# Altium project SDC_V3.0.PrjPcb (part 1 of 2)
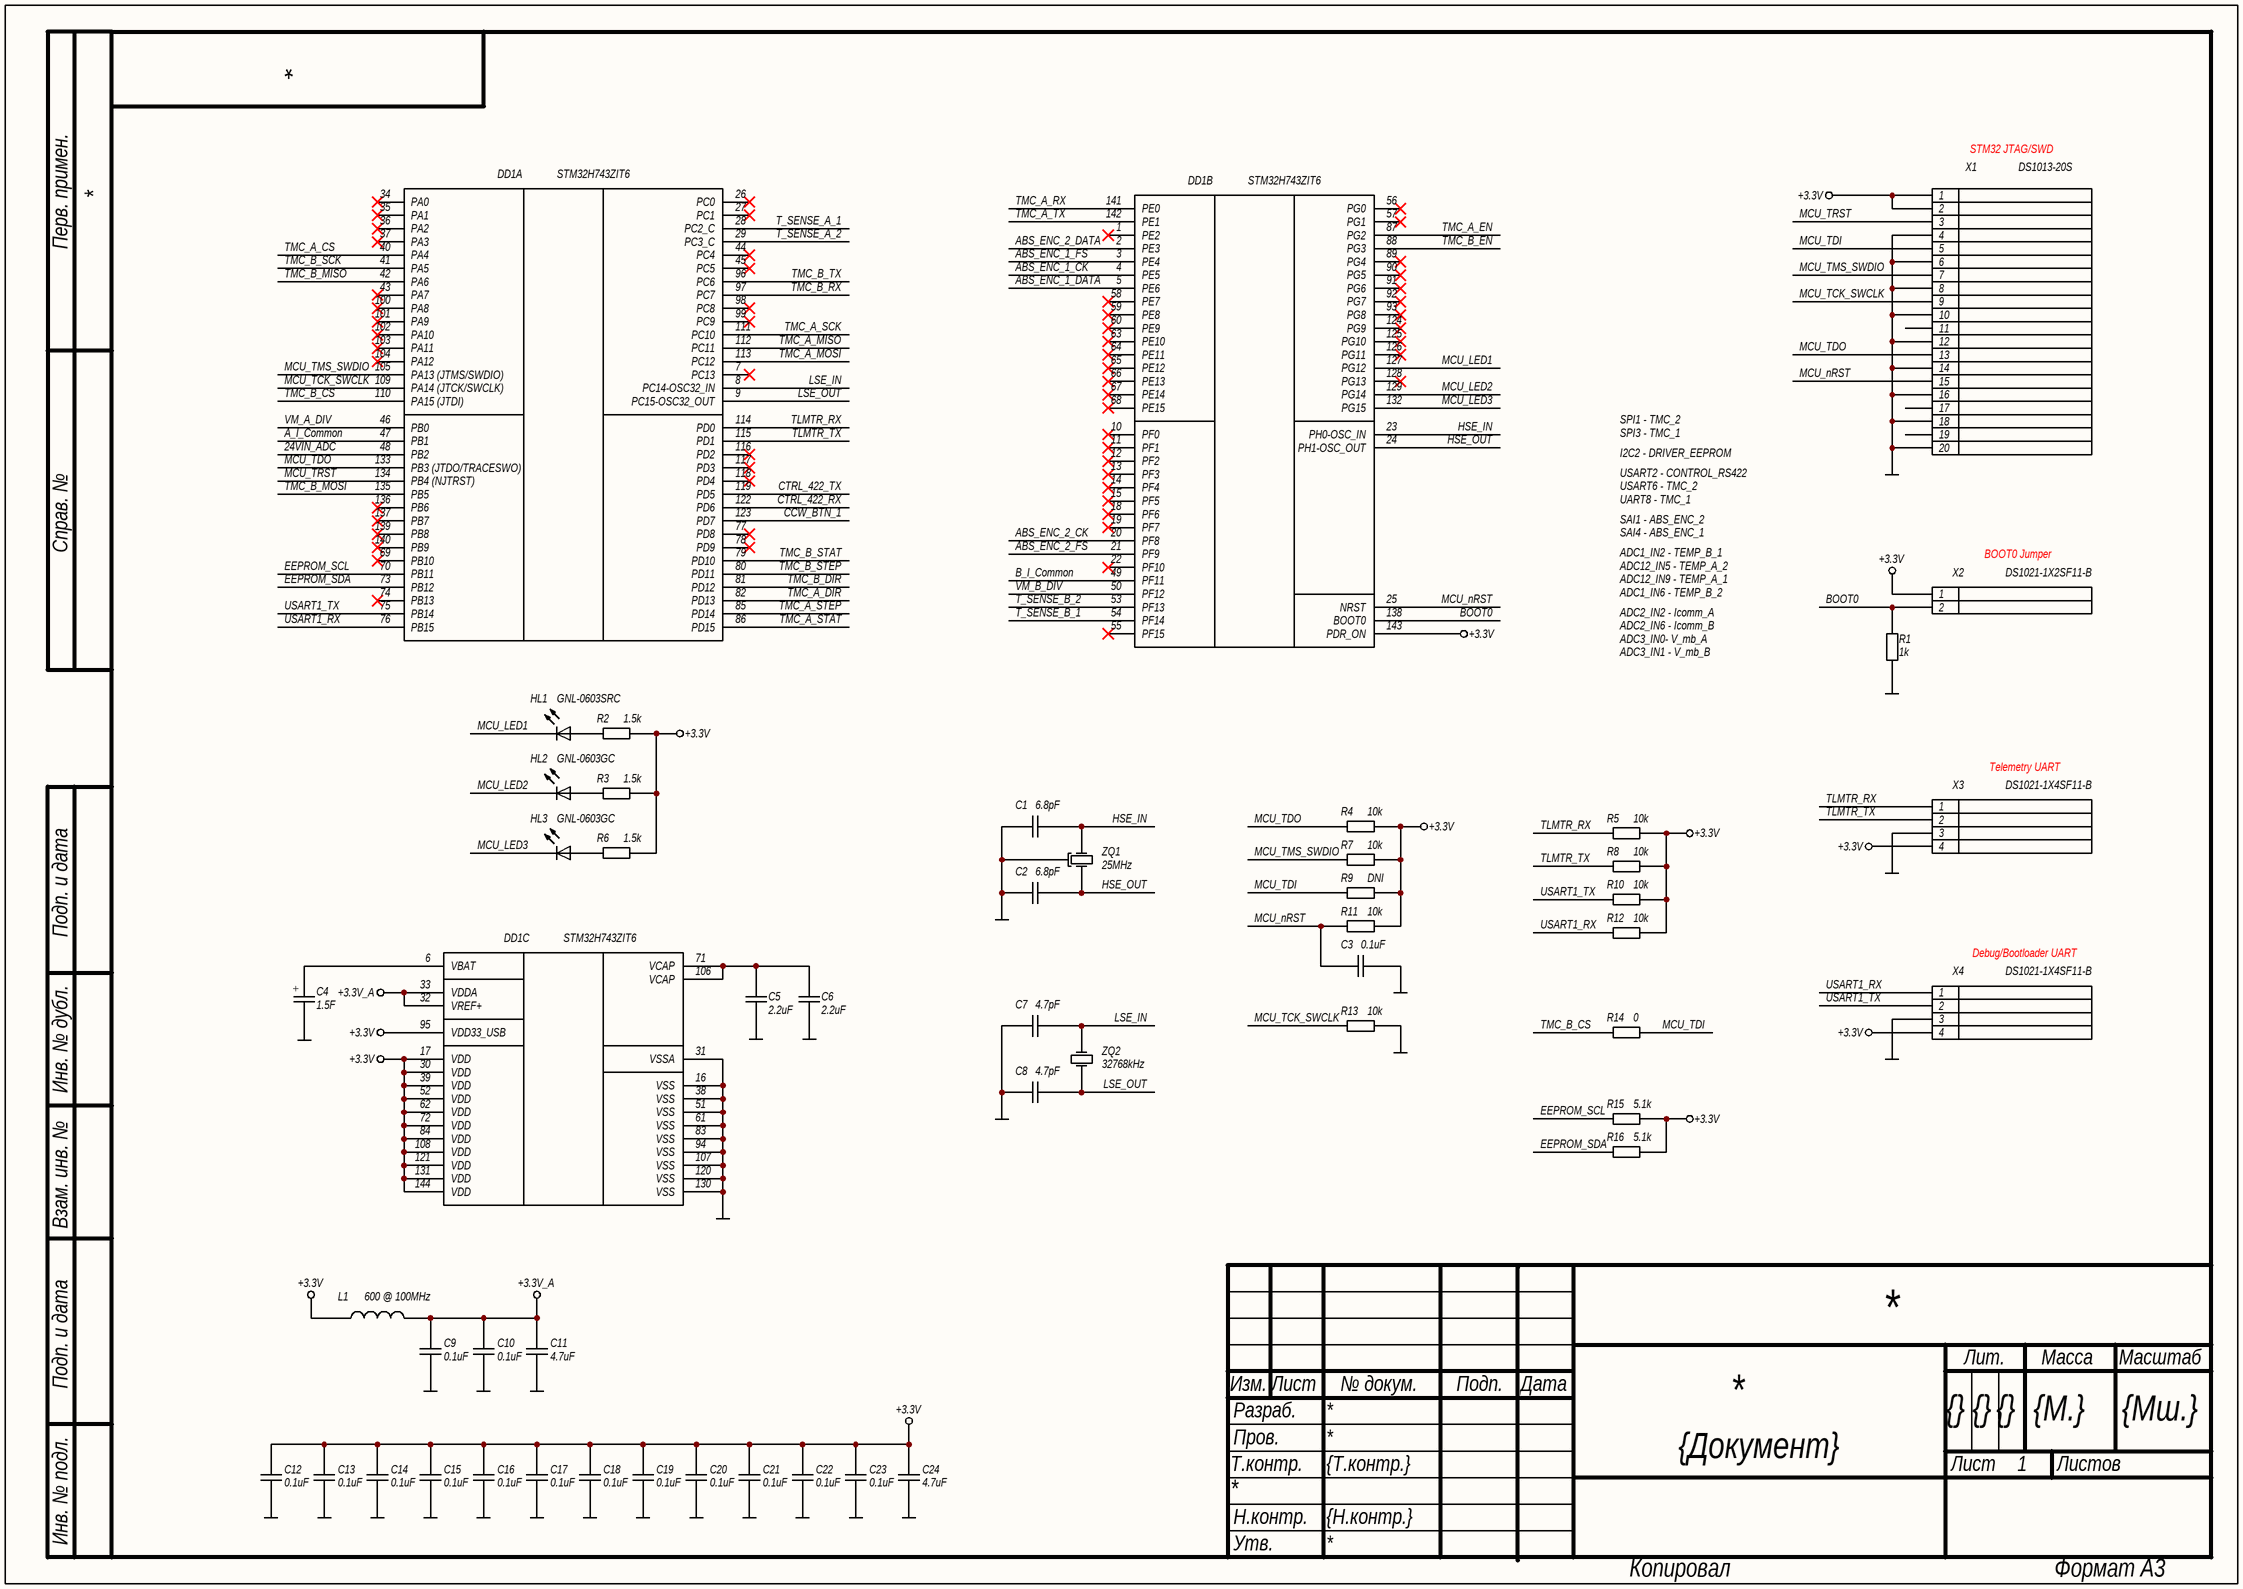
[diagram p0: MCU.SchDoc]
ProjectSheetTotal: 7
9 sheets, 369 parts. Net scope: global (net labels, ports and power ports of the same name join across sheets).
Board file: SDC_V3.0.PcbDoc
Sheets:
  MCU.SchDoc
  DRIVER_A.SchDoc
  DRIVER_B.SchDoc
  ABS_ENC_IF.SchDoc
  INC_ENC_IF.SchDoc
  RS_IF.SchDoc
  POWER.SchDoc
  EXT_LED.SchDoc
  SNS_INPUT.SchDoc

## Sheet MCU.SchDoc
size 420 x 297 mm; SheetNumber: 1; SheetTotal: 7; Scale: {Мш.}; PageSetup: Record=PageOptions|CenterHorizontal=False|CenterVertical=False|PrintScale=0.49|XCorrection=0.00|YCorrection=0.00|PrintKind=1|BorderSize=5000000|LeftOffset=0|BottomOffset=0|Orientation=1|PaperLength=1000|PaperWidth=1000|Scale=100|PaperSource=15|PrintQuality=600|MediaType=1|DitherType=10|PrintScaleMode=1|PaperKind=A4; ProcessInspection: {Т.контр.}; Mass: {М.}; NormInspection: {Н.контр.}; Letter1Column: {}; Letter2Column: {}; Letter3Column: {}; DocumentType: {Документ}

### Parts
C1  6.8pF  [C0603N]
C2  6.8pF  [C0603N]
C3  0.1uF  [C0603N]
C4  1.5F  [KR-5R5H155-R]
C5  2.2uF  [C0603N]
C6  2.2uF  [C0603N]
C7  4.7pF  [C0603N]
C8  4.7pF  [C0603N]
C9  0.1uF  [C0603N]
C10  0.1uF  [C0603N]
C11  4.7uF  [C0603N]
C12  0.1uF  [C0603N]
C13  0.1uF  [C0603N]
C14  0.1uF  [C0603N]
C15  0.1uF  [C0603N]
C16  0.1uF  [C0603N]
C17  0.1uF  [C0603N]
C18  0.1uF  [C0603N]
C19  0.1uF  [C0603N]
C20  0.1uF  [C0603N]
C21  0.1uF  [C0603N]
C22  0.1uF  [C0603N]
C23  0.1uF  [C0603N]
C24  4.7uF  [C0603N]
DD1  STM32H743ZIT6  [LQFP144]  (parts A,B,C of 3)
HL1  GNL-0603SRC  [LED0603]
HL2  GNL-0603GC  [LED0603]
HL3  GNL-0603GC  [LED0603]
L1  600 @ 100MHz  [FB0603N]
R1  1k  [R0603N]
R2  1.5k  [R0603N]
R3  1.5k  [R0603N]
R4  10k  [R0603N]
R5  10k  [R0603N]
R6  1.5k  [R0603N]
R7  10k  [R0603N]
R8  10k  [R0603N]
R9  DNI  [R0603N]  (no BOM)
R10  10k  [R0603N]
R11  10k  [R0603N]
R12  10k  [R0603N]
R13  10k  [R0603N]
R14  0  [R0603N]
R15  5.1k  [R0603N]
R16  5.1k  [R0603N]
X1  DS1013-20S  [2.54_2X10_HEADER_BOX]
X2  DS1021-1X2SF11-B  [2.54_2X1_HEADER]
X3  DS1021-1X4SF11-B  [2.54_4X1_HEADER]
X4  DS1021-1X4SF11-B  [2.54_4X1_HEADER]
ZQ1  25MHz  [NX3225GA]
ZQ2  32768kHz  [NX3215SA]

### Nets
+3.3V: C12.2 C13.2 C14.2 C15.2 C16.2 C17.2 C18.2 C19.2 C20.2 C21.2 C22.2 C23.2 C24.2 DD1.17(VDD) DD1.30(VDD) DD1.39(VDD) DD1.52(VDD) DD1.62(VDD) DD1.72(VDD) DD1.84(VDD) DD1.95(VDD33_USB) DD1.108(VDD) DD1.121(VDD) DD1.131(VDD) DD1.143(PDR_ON) DD1.144(VDD) L1.1 R2.1 R3.1 R4.1 R5.1 R6.1 R7.1 R8.1 R9.1 R10.1 R11.1 R12.1 R15.1 R16.1 X1.1 X1.2 X2.1 X3.4 X4.4
+3.3V_A: C9.2 C10.2 C11.2 DD1.32(VREF+) DD1.33(VDDA) L1.2
GND: C1.2 C2.2 C3.1 C4.1 C5.1 C6.1 C7.2 C8.2 C9.1 C10.1 C11.1 C12.1 C13.1 C14.1 C15.1 C16.1 C17.1 C18.1 C19.1 C20.1 C21.1 C22.1 C23.1 C24.1 DD1.16(VSS) DD1.31(VSSA) DD1.38(VSS) DD1.51(VSS) DD1.61(VSS) DD1.83(VSS) DD1.94(VSS) DD1.107(VSS) DD1.120(VSS) DD1.130(VSS) R1.2 R13.2 X1.4 X1.6 X1.8 X1.10 X1.12 X1.14 X1.16 X1.18 X1.20 X3.3 X4.3 ZQ1.2
24VIN_ADC: DD1.48(PB2)
A_I_Common: DD1.47(PB1)
ABS_ENC_1_CK: DD1.4(PE5)
ABS_ENC_1_DATA: DD1.5(PE6)
ABS_ENC_1_FS: DD1.3(PE4)
ABS_ENC_2_CK: DD1.20(PF8)
ABS_ENC_2_DATA: DD1.2(PE3)
ABS_ENC_2_FS: DD1.21(PF9)
B_I_Common: DD1.49(PF11)
BOOT0: DD1.138(BOOT0) R1.1 X2.2
CCW_BTN_1: DD1.123(PD7)
CTRL_422_RX: DD1.122(PD6)
CTRL_422_TX: DD1.119(PD5)
EEPROM_SCL: DD1.70(PB11) R15.2
EEPROM_SDA: DD1.73(PB12) R16.2
HSE_IN: C1.1 DD1.23(PH0-OSC_IN) ZQ1.1
HSE_OUT: C2.1 DD1.24(PH1-OSC_OUT) ZQ1.3
LSE_IN: C7.1 DD1.8(PC14-OSC32_IN) ZQ2.2
LSE_OUT: C8.1 DD1.9(PC15-OSC32_OUT) ZQ2.1
MCU_LED1: DD1.127(PG12) HL1.1(K)
MCU_LED2: DD1.129(PG14) HL2.1(K)
MCU_LED3: DD1.132(PG15) HL3.1(K)
MCU_nRST: C3.2 DD1.25(NRST) R11.2 X1.15
MCU_TCK_SWCLK: DD1.109(PA14_(JTCK/SWCLK)) R13.1 X1.9
MCU_TDI: R9.2 R14.1 X1.5
MCU_TDO: DD1.133(PB3_(JTDO/TRACESWO)) R4.2 X1.13
MCU_TMS_SWDIO: DD1.105(PA13_(JTMS/SWDIO)) R7.2 X1.7
MCU_TRST: DD1.134(PB4_(NJTRST)) X1.3
T_SENSE_A_1: DD1.28(PC2_C)
T_SENSE_A_2: DD1.29(PC3_C)
T_SENSE_B_1: DD1.54(PF14)
T_SENSE_B_2: DD1.53(PF13)
TLMTR_RX: DD1.114(PD0) R5.2 X3.1
TLMTR_TX: DD1.115(PD1) R8.2 X3.2
TMC_A_CS: DD1.40(PA4)
TMC_A_DIR: DD1.82(PD13)
TMC_A_EN: DD1.87(PG2)
TMC_A_MISO: DD1.112(PC11)
TMC_A_MOSI: DD1.113(PC12)
TMC_A_RX: DD1.141(PE0)
TMC_A_SCK: DD1.111(PC10)
TMC_A_STAT: DD1.86(PD15)
TMC_A_STEP: DD1.85(PD14)
TMC_A_TX: DD1.142(PE1)
TMC_B_CS: DD1.110(PA15_(JTDI)) R14.2
TMC_B_DIR: DD1.81(PD12)
TMC_B_EN: DD1.88(PG3)
TMC_B_MISO: DD1.42(PA6)
TMC_B_MOSI: DD1.135(PB5)
TMC_B_RX: DD1.97(PC7)
TMC_B_SCK: DD1.41(PA5)
TMC_B_STAT: DD1.79(PD10)
TMC_B_STEP: DD1.80(PD11)
TMC_B_TX: DD1.96(PC6)
USART1_RX: DD1.76(PB15) R12.2 X4.1
USART1_TX: DD1.75(PB14) R10.2 X4.2
VM_A_DIV: DD1.46(PB0)
VM_B_DIV: DD1.50(PF12)
NetC4_2: C4.2 DD1.6(VBAT)
NetC5_2: C5.2 C6.2 DD1.71(VCAP) DD1.106(VCAP)
NetHL1_2: HL1.2(A) R2.2
NetHL2_2: HL2.2(A) R3.2
NetHL3_2: HL3.2(A) R6.2

Not connected (* = marked no-connect by the designer): DD1 1(PE2)* 7(PC13)* 10(PF0)* 11(PF1)* 12(PF2)* 13(PF3)* 14(PF4)* 15(PF5)* 18(PF6)* 19(PF7)* 22(PF10)* 26(PC0)* 27(PC1)* 34(PA0)* 35(PA1)* 36(PA2)* 37(PA3)* 43(PA7)* 44(PC4)* 45(PC5)* 55(PF15)* 56(PG0)* 57(PG1)* 58(PE7)* 59(PE8)* 60(PE9)* 63(PE10)* 64(PE11)* 65(PE12)* 66(PE13)* 67(PE14)* 68(PE15)* 69(PB10)* 74(PB13)* 77(PD8)* 78(PD9)* 89(PG4)* 90(PG5)* 91(PG6)* 92(PG7)* 93(PG8)* 98(PC8)* 99(PC9)* 100(PA8)* 101(PA9)* 102(PA10)* 103(PA11)* 104(PA12)* 116(PD2)* 117(PD3)* 118(PD4)* 124(PG9)* 125(PG10)* 126(PG11)* 128(PG13)* 136(PB6)* 137(PB7)* 139(PB8)* 140(PB9)*; X1 11 17 19

### Notes on the sheet
- STM32 JTAG/SWD
- SPI1 - TMC_2
- SPI3 - TMC_1
- I2C2 - DRIVER_EEPROM
- USART2 - CONTROL_RS422
- USART6 - TMC_2
- UART8 - TMC_1
- SAI1 - ABS_ENC_2
- ADC1_IN2 - TEMP_B_1
- ADC12_IN5 - TEMP_A_2
- ADC12_IN9 - TEMP_A_1
- ADC1_IN6 - TEMP_B_2
- SAI4 - ABS_ENC_1
- BOOT0 Jumper
- ADC2_IN2 - Icomm_A
- ADC2_IN6 - Icomm_B
- ADC3_IN0- V_mb_A
- ADC3_IN1 - V_mb_B
- Telemetry UART
- (near X4) Debug/Bootloader UART
- Перв. примен.
- Справ. №
- Подп. и дата
- Инв. № дубл.
- Взам. инв. №
- Изм.
- Лист
- № докум.
- Подп.
- Дата
- Лит.
- Масса
- Масштаб
- Т.контр.
- Пров.
- Разраб.
- Листов
- Инв. № подл.
- Н.контр.
- Утв.
- Копировал
- Формат А3
- (in symbol KR-5R5H155-R) +

### Library data of the parts
C1 C2 = CC0603CRNPO9BN6R8: Конденсатор; Точность: ±0.25pF; Напряжение: 50V; Диэлектрик: NP0; Производитель: YAGEO; Описание: 4.7 pF ±0.25pF 50V Ceramic Capacitor C0G, NP0 0603 (1608 Metric); Корпус: 0603 (1608 Metric); Температурный диапазон: -55°C ~ 125°C; Вид монтажа: SMD; Артикул: CC0603CRNPO9BN6R8; Номинал: 6.8pF; Строка для документации: https://www.yageo.com/upload/media/product/productsearch/datasheet/mlcc/UPY-GP_NP0_16V-to-50V_18.pdf; Тип элемента: Конденсатор
C3 C9 C10 C12-C23 = CL10B104KB8NNNC: Конденсатор; Точность: 10%; Напряжение: 50V; Диэлектрик: X7R; Производитель: Samsung Electro-Mechanics; Описание: 0.1 µF ±10% 50V Ceramic Capacitor X7R 0603 (1608 Metric); Корпус: 0603 (1608 Metric); Температурный диапазон: -55°C ~ 125°C; Вид монтажа: SMD; Артикул: CL10B104KB8NNNC; Номинал: 0.1uF; Строка для документации: https://mm.digikey.com/Volume0/opasdata/d220001/medias/docus/609/CL10B104KB8NNNC_Spec.pdf; Тип элемента: Конденсатор
C4 = KR-5R5H155-R: Ионистор; Точность: -20%, +80%; Напряжение: 5.5V; Диэлектрик: EDLC; Производитель: Eaton - Electronics Division; Описание: 1.5 F (EDLC) Supercapacitor 5.5 V Axial, Can - Horizontal 30Ohm @ 1kHz 1000 Hrs @ 70°C; Корпус: 19.00mm dia x 6.5mm; Температурный диапазон: -25°C ~ 70°C; Вид монтажа: Through Hole; Тип элемента: Конденсатор; Артикул: KR-5R5H155-R; Номинал: 1.5F; Строка для документации: https://www.eaton.com/content/dam/eaton/products/electronic-components/resources/data-sheet/eaton-kr-supercapacitors-coin-cells-data-sheet.pdf
C5 C6 = CL10A225KO8NNNC: Конденсатор; Точность: 10%; Напряжение: 16V; Диэлектрик: X5R; Производитель: Samsung Electro-Mechanics; Описание: 2.2 µF ±10% 16V Ceramic Capacitor X5R 0603 (1608 Metric); Корпус: 0603 (1608 Metric); Температурный диапазон: -55°C ~ 85°C; Вид монтажа: SMD; Артикул: CL10A225KO8NNNC; Номинал: 2.2uF; Строка для документации: https://mm.digikey.com/Volume0/opasdata/d220001/medias/docus/421/CL10A225KO8NNNC_Spec.pdf; Тип элемента: Конденсатор
C7 C8 = CC0603CRNPO9BN4R7: Конденсатор; Точность: ±0.25pF; Напряжение: 50V; Диэлектрик: NP0; Производитель: YAGEO; Описание: 4.7 pF ±0.25pF 50V Ceramic Capacitor C0G, NP0 0603 (1608 Metric); Корпус: 0603 (1608 Metric); Температурный диапазон: -55°C ~ 125°C; Вид монтажа: SMD; Артикул: CC0603CRNPO9BN4R7; Номинал: 4.7pF; Строка для документации: https://www.yageo.com/upload/media/product/productsearch/datasheet/mlcc/UPY-GP_NP0_16V-to-50V_18.pdf; Тип элемента: Конденсатор
C11 C24 = CL10A475KO8NNNC: Конденсатор; Точность: 10%; Напряжение: 16V; Диэлектрик: X5R; Производитель: Samsung Electro-Mechanics; Описание: 4.7 µF ±10% 16V Ceramic Capacitor X5R 0603 (1608 Metric); Корпус: 0603 (1608 Metric); Температурный диапазон: -55°C ~ 85°C; Вид монтажа: SMD; Артикул: CL10A475KO8NNNC; Номинал: 4.7uF; Строка для документации: https://mm.digikey.com/Volume0/opasdata/d220001/medias/docus/2328/CL10A475KO8NNNC_Spec.pdf; Тип элемента: Конденсатор
DD1 = STM32H743ZIT6: Микросхема микроконтроллер; Производитель: STMicroelectronics; Описание: ARM® Cortex®-M7 STM32H7 Microcontroller IC 32-Bit Single-Core 480MHz 2MB (2M x 8) FLASH 144-LQFP (20x20); Корпус: 144-LQFP (20x20); Температурный диапазон: -40°C ~ 85°C (TA); Вид монтажа: SMD; Артикул: STM32H743ZIT6; Строка для документации: https://www.st.com/resource/en/datasheet/stm32h743bi.pdf; Тип элемента: Микросхема
HL1 = GNL-0603SRC: Светодиод; Прямой ток: 20mA; Напряжение: 2V; Яркость: 15mcd; Цвет: Зеленый; Длина волны: 660nm; Производитель: G-nor Electronics; Описание: Green 567nm LED Indication - Discrete 2V 0603 (1608 Metric); Корпус: 0603 (1608 Metric); Температурный диапазон: -40°C ~ 80°C; Вид монтажа: SMD; Тип элемента: Диод светоизлучающий; Артикул: GNL-0603SRC; Строка для документации: https://www.g-nor.com/Uploads/Ed/file/20210517/1621223120713818.doc
HL2 HL3 = GNL-0603GC: Светодиод; Прямой ток: 20mA; Напряжение: 2V; Цвет: Зеленый; Длина волны: 567nm; Производитель: G-nor Electronics; Описание: Green 567nm LED Indication - Discrete 2V 0603 (1608 Metric); Корпус: 0603 (1608 Metric); Температурный диапазон: -40°C ~ 80°C; Вид монтажа: SMD; Тип элемента: Диод светоизлучающий; Артикул: GNL-0603GC; Яркость: LED; Строка для документации: https://www.g-nor.com/Uploads/Ed/file/20210517/1621223120713818.doc
L1 = BLM18AG601SN1D: Фильтр ЭМП индуктивный; Ток: 500mA; Сопротивление: 380m; Тип: Ferrite Bead; Производитель: Murata Electronics; Описание: 600 Ohms @ 100 MHz 1 Ferrite Bead 0603 (1608 Metric) 500mA 380mOhm; Корпус: 0603 (1608 Metric); Температурный диапазон: -55°C ~ 125°C; Вид монтажа: SMD; Артикул: BLM18AG601SN1D; Номинал: 600 @ 100MHz; Строка для документации: https://www.murata.com/en-us/products/productdata/8796738650142/ENFA0003.pdf; Тип элемента: Фильтр ЭМП
R1 = RC0603FR-071KL: Резистор; Точность: 1%; ТКС: ±100ppm/°C; Напряжение: 75V; Производитель: YAGEO; Описание: 1 kOhms ±1% 0.1W, 1/10W Chip Resistor 0603 (1608 Metric) Moisture Resistant Thick Film; Корпус: 0603 (1608 Metric); Температурный диапазон: -55°C ~ 155°C; Вид монтажа: SMD; Артикул: RC0603FR-071KL; Номинал: 1k; Строка для документации: https://www.yageo.com/upload/media/product/app/datasheet/rchip/pyu-rc_group_51_rohs_l.pdf; Тип элемента: Резистор
R2 R3 R6 = RC0603FR-071K5L: Резистор; Точность: 1%; ТКС: ±100ppm/°C; Напряжение: 75V; Производитель: YAGEO; Описание: 1.5 kOhms ±1% 0.1W, 1/10W Chip Resistor 0603 (1608 Metric) Moisture Resistant Thick Film; Корпус: 0603 (1608 Metric); Температурный диапазон: -55°C ~ 155°C; Вид монтажа: SMD; Артикул: RC0603FR-071K5L; Номинал: 1.5k; Строка для документации: https://www.yageo.com/upload/media/product/app/datasheet/rchip/pyu-rc_group_51_rohs_l.pdf; Тип элемента: Резистор
R4 R5 R7-R13 = RC0603FR-0710KL: Резистор; Точность: 1%; ТКС: ±100ppm/°C; Напряжение: 75V; Производитель: YAGEO; Описание: 10 kOhms ±1% 0.1W, 1/10W Chip Resistor 0603 (1608 Metric) Moisture Resistant Thick Film; Корпус: 0603 (1608 Metric); Температурный диапазон: -55°C ~ 155°C; Вид монтажа: SMD; Артикул: RC0603FR-0710KL; Строка для документации: https://www.yageo.com/upload/media/product/app/datasheet/rchip/pyu-rc_group_51_rohs_l.pdf; Тип элемента: Резистор
  R4 R5 R7 R8 R10-R13: Номинал: 10k
  R9: Номинал: DNI
R14 = RC0603FR-070RL: Резистор; Точность: 1%; ТКС: ±100ppm/°C; Напряжение: 75V; Производитель: YAGEO; Описание: 0 Ohms Jumper Chip Resistor 0603 (1608 Metric) Moisture Resistant Thick Film; Корпус: 0603 (1608 Metric); Температурный диапазон: -55°C ~ 155°C; Вид монтажа: SMD; Артикул: RC0603FR-070RL; Номинал: 0; Строка для документации: https://www.yageo.com/upload/media/product/app/datasheet/rchip/pyu-rc_group_51_rohs_l.pdf; Тип элемента: Резистор
R15 R16 = RC0603FR-075K1L: Резистор; Точность: 1%; ТКС: ±100ppm/°C; Напряжение: 75V; Производитель: YAGEO; Описание: 5.1 kOhms ±1% 0.1W, 1/10W Chip Resistor 0603 (1608 Metric) Moisture Resistant Thick Film; Корпус: 0603 (1608 Metric); Температурный диапазон: -55°C ~ 155°C; Вид монтажа: SMD; Артикул: RC0603FR-075K1L; Номинал: 5.1k; Строка для документации: https://www.yageo.com/upload/media/product/app/datasheet/rchip/pyu-rc_group_51_rohs_l.pdf; Тип элемента: Резистор
X1 = DS1013-20S: Разъем, 20 контактов; Тип разъема: Header, Male Pin; Количество контактов: 20; Шаг контактов: 2.54mm; Ток: 3A; Напряжение: 250V; Производитель: Connfly electronic (Zhenqin); Описание: Connector Header Through Hole 30 position 0.100" (2.54mm); Температурный диапазон: -40°C ~ 105°C; Вид монтажа: Through Hole; Артикул: DS1013-20S; Строка для документации: http://cn.connfly.group/static/upload/file/pdf/DS1013.pdf; Тип элемента: Разъем
X2 = DS1021-1X2SF11-B: Разъем, 2 контакта; Тип разъема: Header, Male Pin; Количество контактов: 2; Шаг контактов: 2.54mm; Ток: 3A; Напряжение: 250V; Производитель: Connfly electronic (Zhenqin); Описание: Connector Header Through Hole 2 position 0.100" (2.54mm); Температурный диапазон: -40°C ~ 105°C; Вид монтажа: Through Hole; Артикул: DS1021-1X2SF11-B; Строка для документации: http://cn.connfly.group/static/upload/file/pdf/DS1021.pdf; Тип элемента: Разъем
X3 X4 = DS1021-1X4SF11-B: Разъем, 4 контакта; Тип разъема: Header, Male Pin; Количество контактов: 4; Шаг контактов: 2.54mm; Ток: 3A; Напряжение: 250V; Производитель: Connfly electronic (Zhenqin); Описание: Connector Header Through Hole 4 position 0.100" (2.54mm); Температурный диапазон: -40°C ~ 105°C; Вид монтажа: Through Hole; Артикул: DS1021-1X4SF11-B; Строка для документации: http://cn.connfly.group/static/upload/file/pdf/DS1021.pdf; Тип элемента: Разъем
ZQ1 = NX3225GA-25.000M: Кварцевый резонатор, экранированный; Точность: ±20ppm; Описание: 25 MHz ±20ppm Crystal 8pF 50 Ohms 4-SMD, No Lead; Тип: MHz Crystal; Производитель: NDK America, Inc.; Температурный диапазон: -40°C ~ 85°C; Корпус: 3.20mm x 2.50mm; Вид монтажа: SMD; Артикул: NX3225GA-25.000M; Частота: 25MHz; Строка для документации: https://www.ndk.com/en/products/upload/lineup/pdf/NDKX03-00006_en.pdf; Тип элемента: Кварцевый резонатор
ZQ2 = NX3215SA-32.768K: Кварцевый резонатор; Точность: ±20ppm; Описание: 32.768 kHz ±20ppm Crystal 7pF 70 kOhms 2-SMD, No Lead; Тип: kHz Crystal (Tuning Fork); Производитель: NDK America, Inc.; Температурный диапазон: -40°C ~ 85°C; Корпус: 3.20mm x 1.50mm; Вид монтажа: SMD; Артикул: NX3215SA-32.768K; Частота: 32768kHz; Строка для документации: https://www.ndk.com/images/products/catalog/c_NX3215SA_e.pdf; Тип элемента: Кварцевый резонатор

## Sheet DRIVER_A.SchDoc
size 420 x 297 mm; SheetNumber: 2; PageSetup: Record=PageOptions|CenterHorizontal=False|CenterVertical=False|PrintScale=0.95|XCorrection=0.00|YCorrection=0.00|PrintKind=1|BorderSize=5000000|LeftOffset=0|BottomOffset=0|Orientation=1|PaperLength=1000|PaperWidth=1000|Scale=100|PaperSource=15|PrintQuality=600|MediaType=1|DitherType=10|PaperKind=A4|PrintScaleMode=1
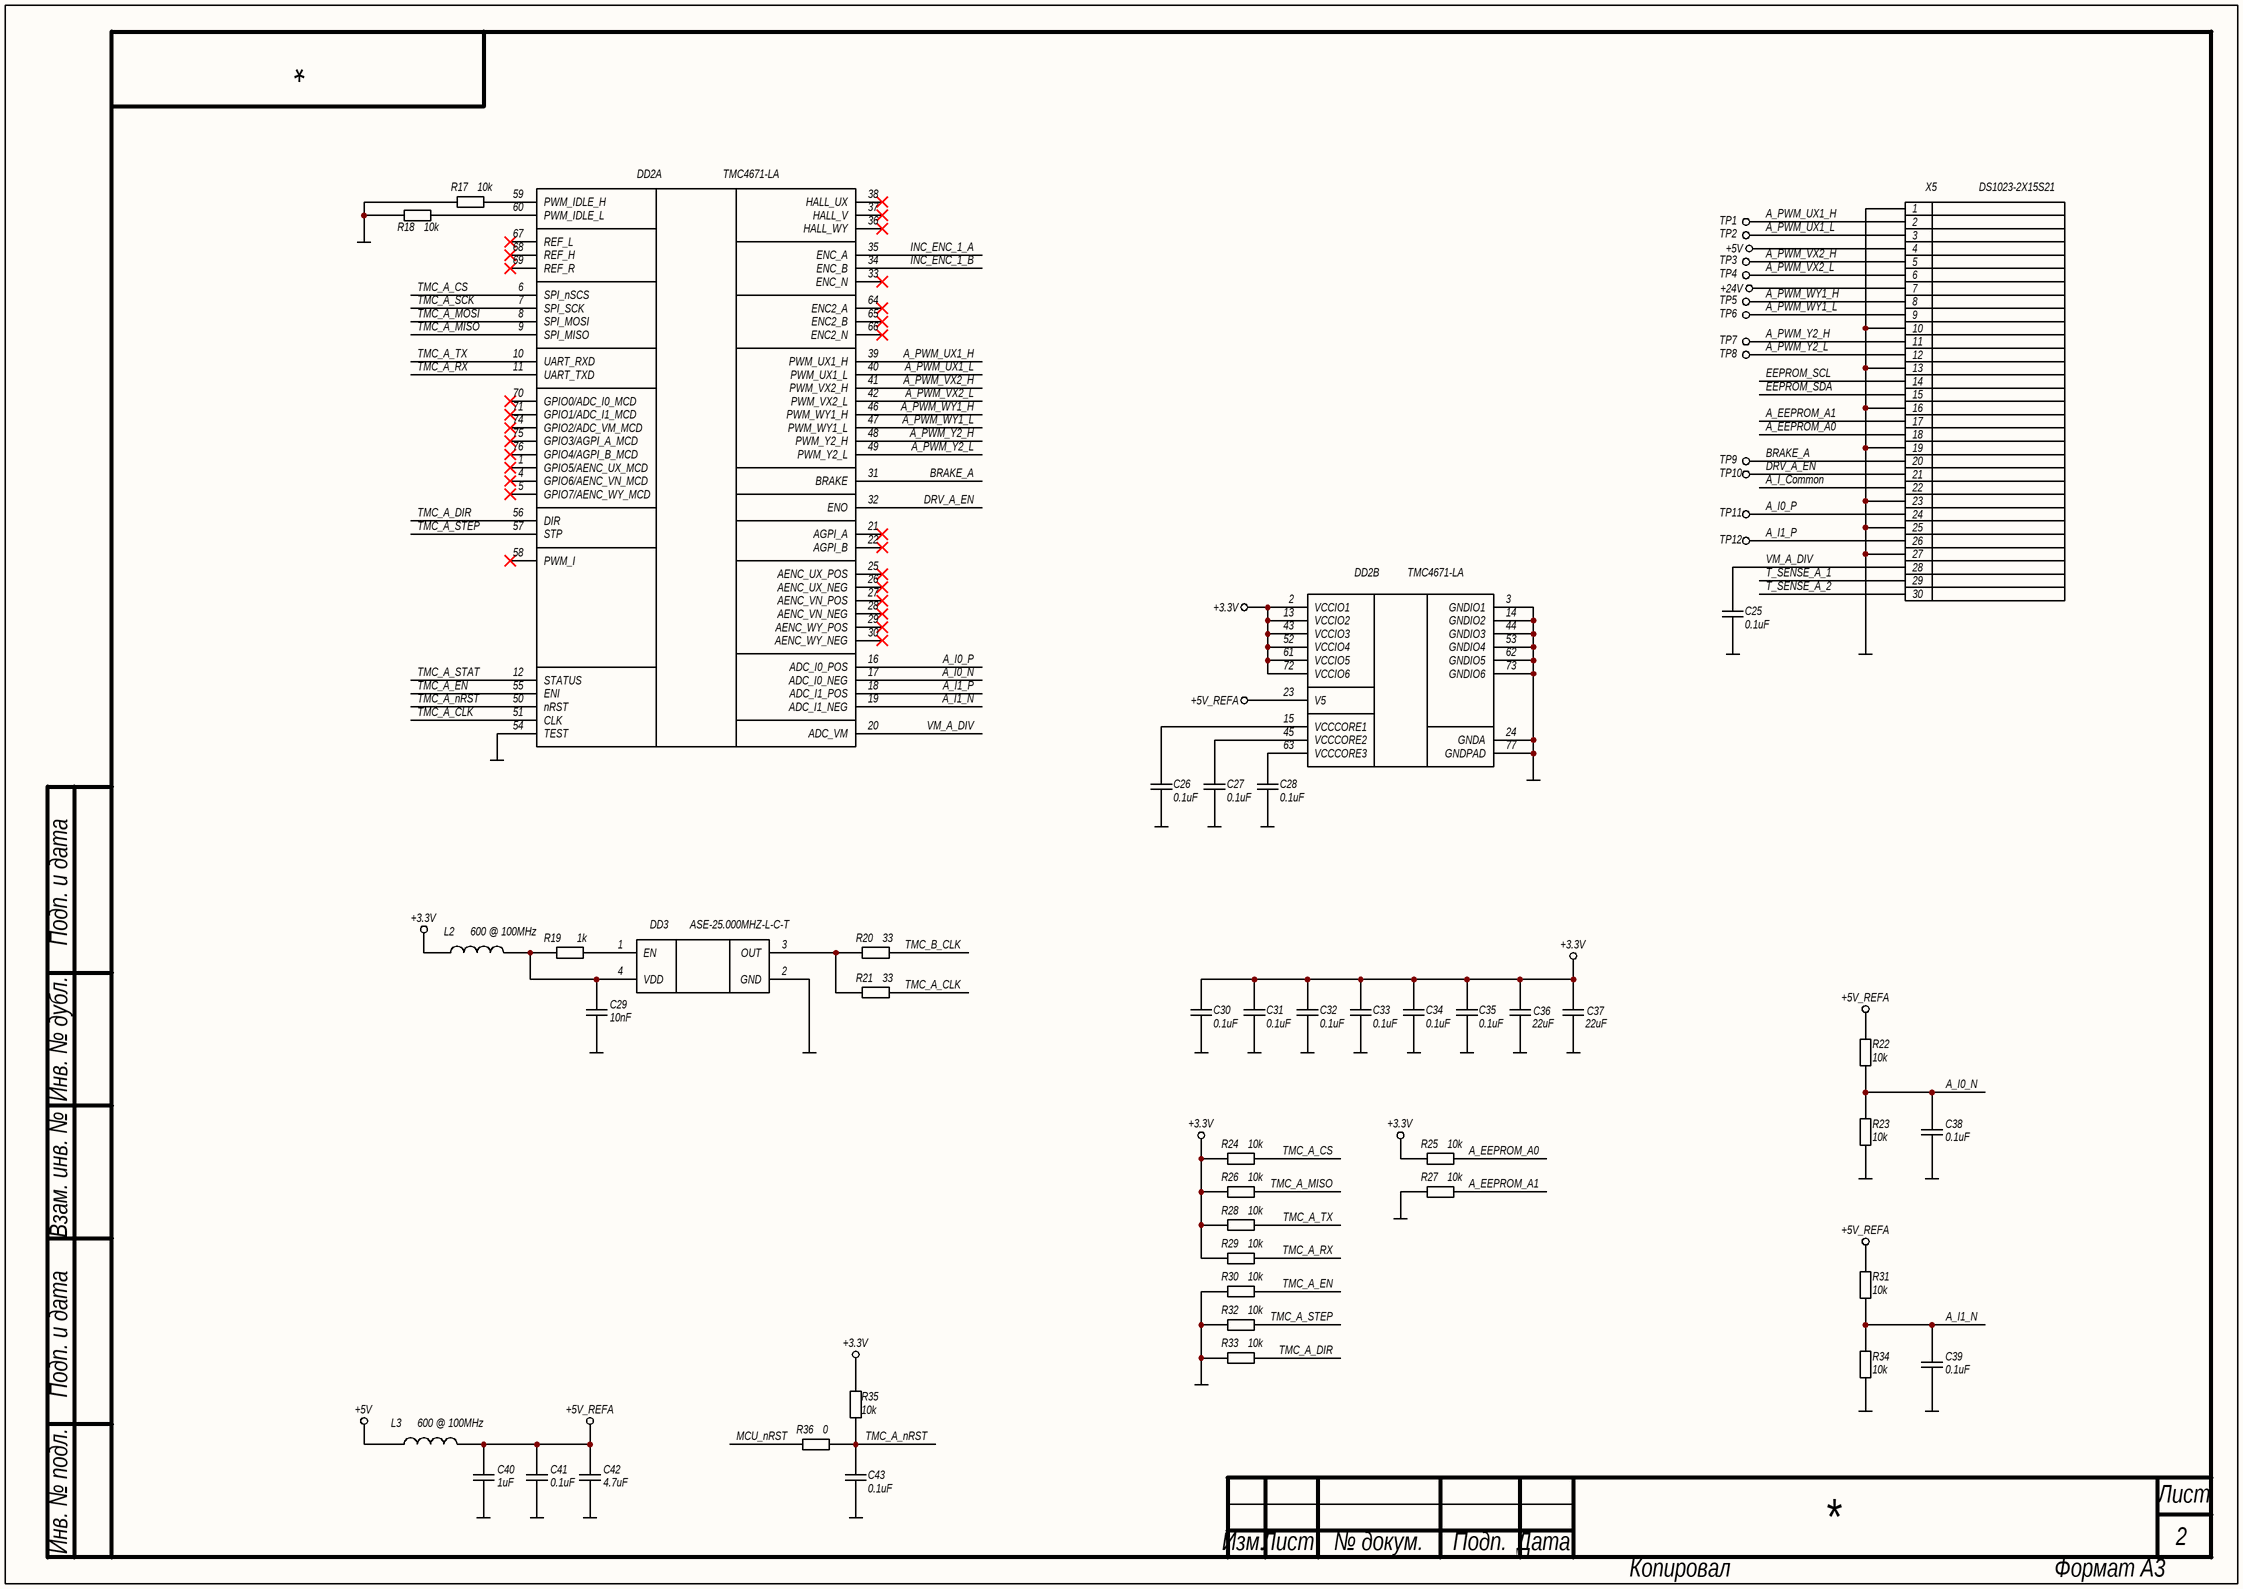
[diagram p1: DRIVER_A.SchDoc]

### Parts
C25  0.1uF  [C0603N]
C26  0.1uF  [C0603N]
C27  0.1uF  [C0603N]
C28  0.1uF  [C0603N]
C29  10nF  [C0603N]
C30  0.1uF  [C0603N]
C31  0.1uF  [C0603N]
C32  0.1uF  [C0603N]
C33  0.1uF  [C0603N]
C34  0.1uF  [C0603N]
C35  0.1uF  [C0603N]
C36  22uF  [C0805N]
C37  22uF  [C0805N]
C38  0.1uF  [C0603N]
C39  0.1uF  [C0603N]
C40  1uF  [C0603N]
C41  0.1uF  [C0603N]
C42  4.7uF  [C0603N]
C43  0.1uF  [C0603N]
DD2  TMC4671-LA  [QFN76-EP]  (parts A,B of 2)
DD3  ASE-25.000MHZ-L-C-T  [ASE]
L2  600 @ 100MHz  [FB0603N]
L3  600 @ 100MHz  [FB0603N]
R17  10k  [R0603N]
R18  10k  [R0603N]
R19  1k  [R0603N]
R20  33  [R0603N]
R21  33  [R0603N]
R22  10k  [R0603N]
R23  10k  [R0603N]
R24  10k  [R0603N]
R25  10k  [R0603N]
R26  10k  [R0603N]
R27  10k  [R0603N]
R28  10k  [R0603N]
R29  10k  [R0603N]
R30  10k  [R0603N]
R31  10k  [R0603N]
R32  10k  [R0603N]
R33  10k  [R0603N]
R34  10k  [R0603N]
R35  10k  [R0603N]
R36  0  [R0603N]
TP1  TEST_POINT  [TP_RPAD_0.8MM]  (value not drawn)  (no BOM)
TP2  TEST_POINT  [TP_RPAD_0.8MM]  (value not drawn)  (no BOM)
TP3  TEST_POINT  [TP_RPAD_0.8MM]  (value not drawn)  (no BOM)
TP4  TEST_POINT  [TP_RPAD_0.8MM]  (value not drawn)  (no BOM)
TP5  TEST_POINT  [TP_RPAD_0.8MM]  (value not drawn)  (no BOM)
TP6  TEST_POINT  [TP_RPAD_0.8MM]  (value not drawn)  (no BOM)
TP7  TEST_POINT  [TP_RPAD_0.8MM]  (value not drawn)  (no BOM)
TP8  TEST_POINT  [TP_RPAD_0.8MM]  (value not drawn)  (no BOM)
TP9  TEST_POINT  [TP_RPAD_0.8MM]  (value not drawn)  (no BOM)
TP10  TEST_POINT  [TP_RPAD_0.8MM]  (value not drawn)  (no BOM)
TP11  TEST_POINT  [TP_RPAD_0.8MM]  (value not drawn)  (no BOM)
TP12  TEST_POINT  [TP_RPAD_0.8MM]  (value not drawn)  (no BOM)
X5  DS1023-2X15S21  [2.54_2X15_SOCKET_HEADER]

### Nets
+3.3V: C30.2 C31.2 C32.2 C33.2 C34.2 C35.2 C36.2 C37.2 DD2.2(VCCIO1) DD2.13(VCCIO2) DD2.43(VCCIO3) DD2.52(VCCIO4) DD2.61(VCCIO5) DD2.72(VCCIO6) L2.2 R24.2 R25.2 R26.2 R28.2 R29.2 R35.2
+5V: L3.1 X5.4
+5V_REFA: C40.2 C41.2 C42.2 DD2.23(V5) L3.2 R22.2 R31.2
+24V: X5.7
GND: C25.1 C26.1 C27.1 C28.1 C29.2 C30.1 C31.1 C32.1 C33.1 C34.1 C35.1 C36.1 C37.1 C38.1 C39.1 C40.1 C41.1 C42.1 C43.1 DD2.3(GNDIO1) DD2.14(GNDIO2) DD2.24(GNDA) DD2.44(GNDIO3) DD2.53(GNDIO4) DD2.54(TEST) DD2.62(GNDIO5) DD2.73(GNDIO6) DD2.77(GNDPAD) DD3.2(GND) R17.2 R18.2 R23.1 R27.2 R30.2 R32.2 R33.2 R34.1 X5.1 X5.10 X5.13 X5.16 X5.19 X5.23 X5.25 X5.27
A_EEPROM_A0: R25.1 X5.18
A_EEPROM_A1: R27.1 X5.17
A_I0_N: C38.2 DD2.17(ADC_I0_NEG) R22.1 R23.2
A_I0_P: DD2.16(ADC_I0_POS) TP11.1 X5.24
A_I1_N: C39.2 DD2.19(ADC_I1_NEG) R31.1 R34.2
A_I1_P: DD2.18(ADC_I1_POS) TP12.1 X5.26
A_I_Common: X5.22
A_PWM_UX1_H: DD2.39(PWM_UX1_H) TP1.1 X5.2
A_PWM_UX1_L: DD2.40(PWM_UX1_L) TP2.1 X5.3
A_PWM_VX2_H: DD2.41(PWM_VX2_H) TP3.1 X5.5
A_PWM_VX2_L: DD2.42(PWM_VX2_L) TP4.1 X5.6
A_PWM_WY1_H: DD2.46(PWM_WY1_H) TP5.1 X5.8
A_PWM_WY1_L: DD2.47(PWM_WY1_L) TP6.1 X5.9
A_PWM_Y2_H: DD2.48(PWM_Y2_H) TP7.1 X5.11
A_PWM_Y2_L: DD2.49(PWM_Y2_L) TP8.1 X5.12
BRAKE_A: DD2.31(BRAKE) TP9.1 X5.20
DRV_A_EN: DD2.32(ENO) TP10.1 X5.21
EEPROM_SCL: X5.14
EEPROM_SDA: X5.15
INC_ENC_1_A: DD2.35(ENC_A)
INC_ENC_1_B: DD2.34(ENC_B)
MCU_nRST: R36.2
T_SENSE_A_1: X5.29
T_SENSE_A_2: X5.30
TMC_A_CLK: DD2.51(CLK) R21.1
TMC_A_CS: DD2.6(SPI_nSCS) R24.1
TMC_A_DIR: DD2.56(DIR) R33.1
TMC_A_EN: DD2.55(ENI) R30.1
TMC_A_MISO: DD2.9(SPI_MISO) R26.1
TMC_A_MOSI: DD2.8(SPI_MOSI)
TMC_A_nRST: C43.2 DD2.50(nRST) R35.1 R36.1
TMC_A_RX: DD2.11(UART_TXD) R29.1
TMC_A_SCK: DD2.7(SPI_SCK)
TMC_A_STAT: DD2.12(STATUS)
TMC_A_STEP: DD2.57(STP) R32.1
TMC_A_TX: DD2.10(UART_RXD) R28.1
TMC_B_CLK: R20.1
VM_A_DIV: C25.2 DD2.20(ADC_VM) X5.28
NetC26_2: C26.2 DD2.15(VCCCORE1)
NetC27_2: C27.2 DD2.45(VCCCORE2)
NetC28_2: C28.2 DD2.63(VCCCORE3)
NetC29_1: C29.1 DD3.4(VDD) L2.1 R19.1
NetDD2_59: DD2.59(PWM_IDLE_H) R17.1
NetDD2_60: DD2.60(PWM_IDLE_L) R18.1
NetDD3_1: DD3.1(EN) R19.2
NetDD3_3: DD3.3(OUT) R20.2 R21.2

Not connected (* = marked no-connect by the designer): DD2 1(GPIO5/AENC_UX_MCD)* 4(GPIO6/AENC_VN_MCD)* 5(GPIO7/AENC_WY_MCD)* 21(AGPI_A)* 22(AGPI_B)* 25(AENC_UX_POS)* 26(AENC_UX_NEG)* 27(AENC_VN_POS)* 28(AENC_VN_NEG)* 29(AENC_WY_POS)* 30(AENC_WY_NEG)* 33(ENC_N)* 36(HALL_WY)* 37(HALL_V)* 38(HALL_UX)* 58(PWM_I)* 64(ENC2_A)* 65(ENC2_B)* 66(ENC2_N)* 67(REF_L)* 68(REF_H)* 69(REF_R)* 70(GPIO0/ADC_I0_MCD)* 71(GPIO1/ADC_I1_MCD)* 74(GPIO2/ADC_VM_MCD)* 75(GPIO3/AGPI_A_MCD)* 76(GPIO4/AGPI_B_MCD)*

### Notes on the sheet
- Подп. и дата
- Инв. № дубл.
- Взам. инв. №
- Инв. № подл.
- Лист
- Изм.
- № докум.
- Подп.
- Дата
- Копировал
- Формат А3

### Library data of the parts
C25-C28 C30-C35 C38 C39 C41 C43 = CL10B104KB8NNNC: as C3 on sheet MCU; Артикул: CL10B104KB8NNNC; Номинал: 0.1uF; Строка для документации: https://mm.digikey.com/Volume0/opasdata/d220001/medias/docus/609/CL10B104KB8NNNC_Spec.pdf; Тип элемента: Конденсатор
C29 = CL10B103KB8NNNC: Конденсатор; Точность: 10%; Напряжение: 16V; Диэлектрик: X7R; Производитель: Samsung Electro-Mechanics; Описание: 10000 pF ±10% 50V Ceramic Capacitor X7R 0603 (1608 Metric); Корпус: 0603 (1608 Metric); Температурный диапазон: -55°C ~ 125°C; Вид монтажа: SMD; Артикул: CL10B103KB8NNNC; Номинал: 10nF; Строка для документации: https://mm.digikey.com/Volume0/opasdata/d220001/medias/docus/609/CL10B103KB8NNNC_Spec.pdf; Тип элемента: Конденсатор
C36 C37 = CL21A226MOCLRNC: Конденсатор; Точность: 20%; Напряжение: 16V; Диэлектрик: X5R; Производитель: Samsung Electro-Mechanics; Описание: 22 µF ±20% 16V Ceramic Capacitor X5R 0805 (2012 Metric); Корпус: 0805 (2012 Metric); Температурный диапазон: -55°C ~ 85°C; Вид монтажа: SMD; Артикул: CL21A226MOCLRNC; Номинал: 22uF; Строка для документации: https://mm.digikey.com/Volume0/opasdata/d220001/medias/docus/43/CL21A226MOCLRNC_Spec.pdf; Тип элемента: Конденсатор
C40 = CL10B105KO8NNNC: Конденсатор; Точность: 10%; Напряжение: 16V; Диэлектрик: X7R; Производитель: YAGEO; Описание: 1 µF ±10% 16V Ceramic Capacitor X7R 0603 (1608 Metric); Корпус: 0603 (1608 Metric); Температурный диапазон: -55°C ~ 125°C; Вид монтажа: SMD; Артикул: CL10B105KO8NNNC; Номинал: 1uF; Строка для документации: https://weblib.samsungsem.com/mlcc/mlcc-ec-data-sheet.do?partNumber=CL10B105KO8NNN; Тип элемента: Конденсатор
C42 = CL10A475KO8NNNC: as C11 on sheet MCU; Артикул: CL10A475KO8NNNC; Номинал: 4.7uF; Строка для документации: https://mm.digikey.com/Volume0/opasdata/d220001/medias/docus/2328/CL10A475KO8NNNC_Spec.pdf; Тип элемента: Конденсатор
DD2 = TMC4671-LA: Микросхема драйвер двигателя; Производитель: Analog Devices Inc.; Описание: Multiphase Motor Driver Power MOSFET SPI, Step/Direction 76-QFN (10.5x6.5); Корпус: 76-VFQFN Exposed Pad; Температурный диапазон: -40°C ~ 125°C (TJ); Вид монтажа: SMD; Артикул: TMC4671-LA; Строка для документации: https://www.analog.com/media/en/technical-documentation/data-sheets/TMC4671-LA_datasheet_Rev2.07.pdf; Тип элемента: Микросхема
DD3 = ASE-25.000MHZ-L-C-T: Кварцевый генератор; Частота: 25MHz; Точность: ±50ppm; Описание: 25 MHz XO (Standard) CMOS Oscillator 3.3V Enable/Disable 4-SMD, No Lead; Тип: XO (Standard); Производитель: Abracon LLC; Температурный диапазон: -40°C ~ 85°C; Корпус: 3.20mm x 2.50mm; Вид монтажа: SMD; Артикул: ASE-25.000MHZ-L-C-T; Строка для документации: https://abracon.com/Oscillators/ASEseries.pdf; Тип элемента: Кварцевый генератор
L2 L3 = BLM18AG601SN1D: as L1 on sheet MCU; Артикул: BLM18AG601SN1D; Номинал: 600 @ 100MHz; Строка для документации: https://www.murata.com/en-us/products/productdata/8796738650142/ENFA0003.pdf; Тип элемента: Фильтр ЭМП
R17 R18 R22-R35 = RC0603FR-0710KL: as R4 on sheet MCU; Артикул: RC0603FR-0710KL; Номинал: 10k; Строка для документации: https://www.yageo.com/upload/media/product/app/datasheet/rchip/pyu-rc_group_51_rohs_l.pdf; Тип элемента: Резистор
R19 = RC0603FR-071KL: as R1 on sheet MCU; Артикул: RC0603FR-071KL; Номинал: 1k; Строка для документации: https://www.yageo.com/upload/media/product/app/datasheet/rchip/pyu-rc_group_51_rohs_l.pdf; Тип элемента: Резистор
R20 R21 = RC0603FR-0733RL: Резистор; Точность: 1%; ТКС: ±100ppm/°C; Напряжение: 75V; Производитель: YAGEO; Описание: 33 Ohms ±1% 0.1W, 1/10W Chip Resistor 0603 (1608 Metric) Moisture Resistant Thick Film; Корпус: 0603 (1608 Metric); Температурный диапазон: -55°C ~ 155°C; Вид монтажа: SMD; Артикул: RC0603FR-0733RL; Номинал: 33; Строка для документации: https://www.yageo.com/upload/media/product/app/datasheet/rchip/pyu-rc_group_51_rohs_l.pdf; Тип элемента: Резистор
R36 = RC0603FR-070RL: as R14 on sheet MCU; Артикул: RC0603FR-070RL; Номинал: 0; Строка для документации: https://www.yageo.com/upload/media/product/app/datasheet/rchip/pyu-rc_group_51_rohs_l.pdf; Тип элемента: Резистор
TP1-TP12 = Test Point, Round Pad, 0.8mm diameter: Контрольная точка; Количество контактов: 1; Тип элемента: Разъем; Артикул: Test Point, Round Pad, 0.8mm diameter; Тип разъема: Test Point; Описание: Test Point, Round Pad, 0.8mm diameter
X5 = DS1023-2X15S21: Разъем, 30 контактов; Тип разъема: Header, Female Socket; Количество контактов: 30; Шаг контактов: 2.54mm; Ток: 3A; Напряжение: 250V; Производитель: Connfly electronic (Zhenqin); Описание: Connector Header Through Hole 30 position 0.100" (2.54mm); Температурный диапазон: -40°C ~ 105°C; Вид монтажа: Through Hole; Артикул: DS1023-2X15S21; Строка для документации: http://cn.connfly.group/static/upload/file/pdf/DS1023.pdf; Тип элемента: Разъем

## Sheet DRIVER_B.SchDoc
size 420 x 297 mm; SheetNumber: 3; PageSetup: Record=PageOptions|CenterHorizontal=False|CenterVertical=False|PrintScale=0.95|XCorrection=0.00|YCorrection=0.00|PrintKind=1|BorderSize=5000000|LeftOffset=0|BottomOffset=0|Orientation=1|PaperLength=1000|PaperWidth=1000|Scale=100|PaperSource=15|PrintQuality=600|MediaType=1|DitherType=10|PaperKind=A4|PrintScaleMode=1
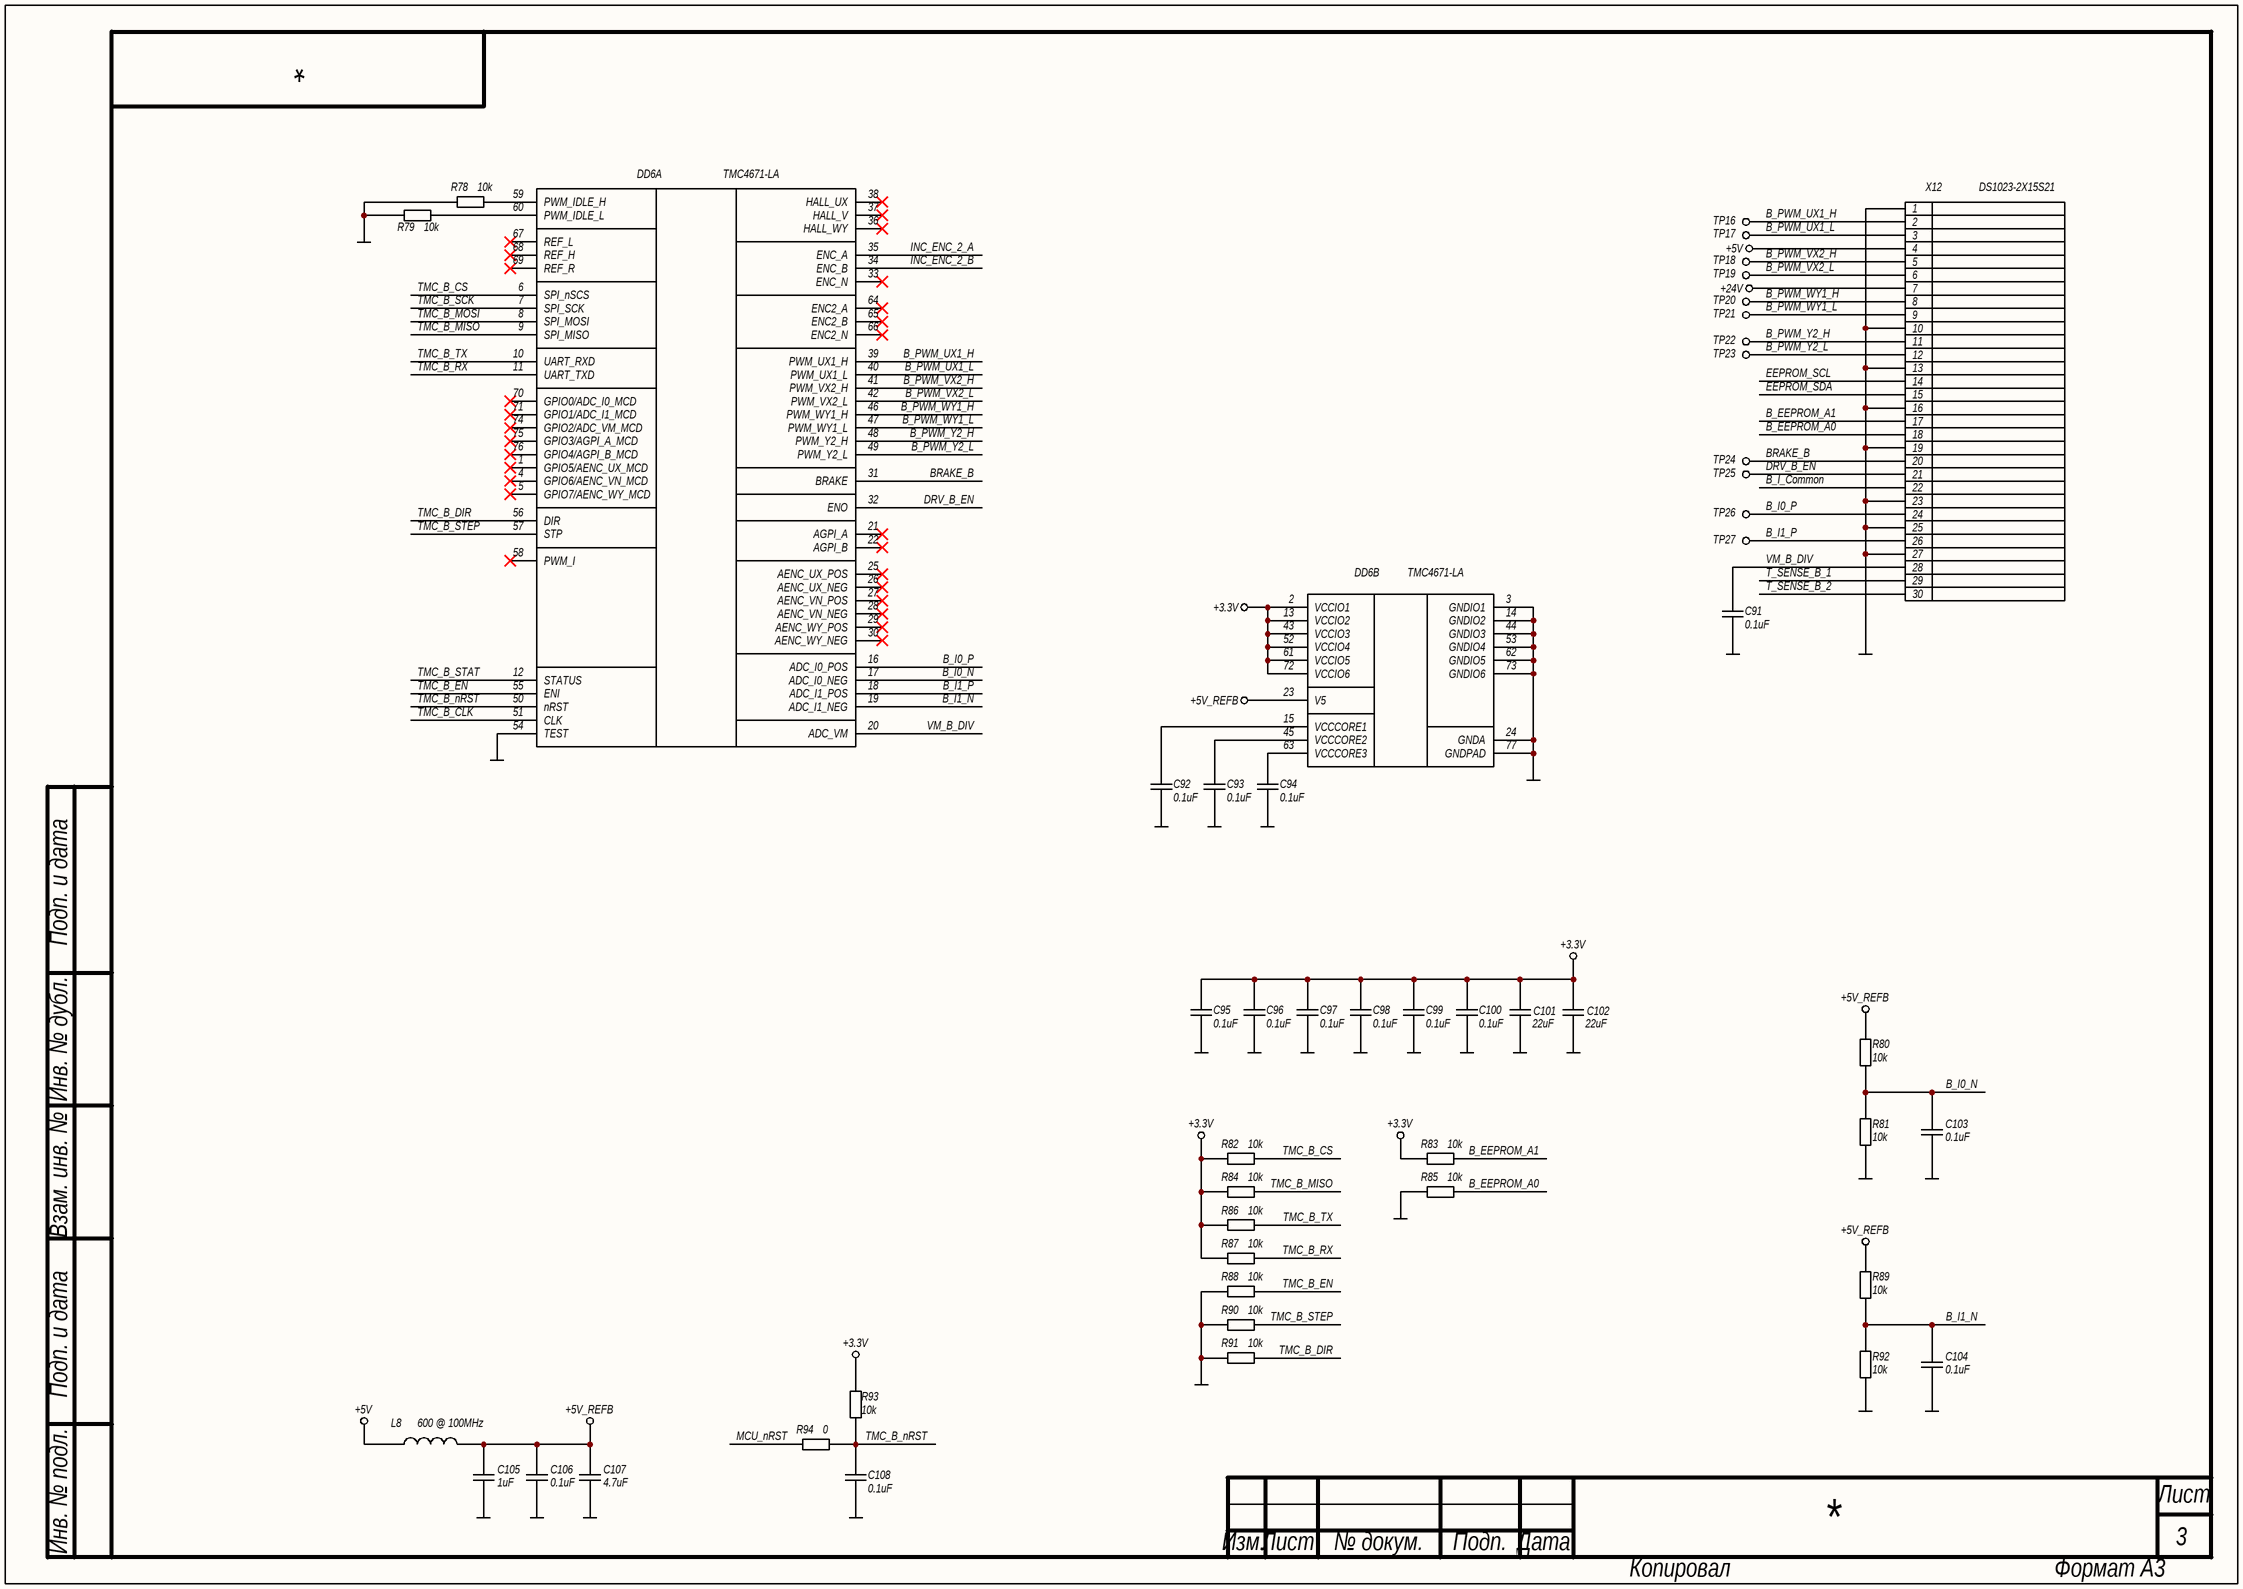
[diagram p2: DRIVER_B.SchDoc]

### Parts
C91  0.1uF  [C0603N]
C92  0.1uF  [C0603N]
C93  0.1uF  [C0603N]
C94  0.1uF  [C0603N]
C95  0.1uF  [C0603N]
C96  0.1uF  [C0603N]
C97  0.1uF  [C0603N]
C98  0.1uF  [C0603N]
C99  0.1uF  [C0603N]
C100  0.1uF  [C0603N]
C101  22uF  [C0805N]
C102  22uF  [C0805N]
C103  0.1uF  [C0603N]
C104  0.1uF  [C0603N]
C105  1uF  [C0603N]
C106  0.1uF  [C0603N]
C107  4.7uF  [C0603N]
C108  0.1uF  [C0603N]
DD6  TMC4671-LA  [QFN76-EP]  (parts A,B of 2)
L8  600 @ 100MHz  [FB0603N]
R78  10k  [R0603N]
R79  10k  [R0603N]
R80  10k  [R0603N]
R81  10k  [R0603N]
R82  10k  [R0603N]
R83  10k  [R0603N]
R84  10k  [R0603N]
R85  10k  [R0603N]
R86  10k  [R0603N]
R87  10k  [R0603N]
R88  10k  [R0603N]
R89  10k  [R0603N]
R90  10k  [R0603N]
R91  10k  [R0603N]
R92  10k  [R0603N]
R93  10k  [R0603N]
R94  0  [R0603N]
TP16  TEST_POINT  [TP_RPAD_0.8MM]  (value not drawn)  (no BOM)
TP17  TEST_POINT  [TP_RPAD_0.8MM]  (value not drawn)  (no BOM)
TP18  TEST_POINT  [TP_RPAD_0.8MM]  (value not drawn)  (no BOM)
TP19  TEST_POINT  [TP_RPAD_0.8MM]  (value not drawn)  (no BOM)
TP20  TEST_POINT  [TP_RPAD_0.8MM]  (value not drawn)  (no BOM)
TP21  TEST_POINT  [TP_RPAD_0.8MM]  (value not drawn)  (no BOM)
TP22  TEST_POINT  [TP_RPAD_0.8MM]  (value not drawn)  (no BOM)
TP23  TEST_POINT  [TP_RPAD_0.8MM]  (value not drawn)  (no BOM)
TP24  TEST_POINT  [TP_RPAD_0.8MM]  (value not drawn)  (no BOM)
TP25  TEST_POINT  [TP_RPAD_0.8MM]  (value not drawn)  (no BOM)
TP26  TEST_POINT  [TP_RPAD_0.8MM]  (value not drawn)  (no BOM)
TP27  TEST_POINT  [TP_RPAD_0.8MM]  (value not drawn)  (no BOM)
X12  DS1023-2X15S21  [2.54_2X15_SOCKET_HEADER]

### Nets
+3.3V: C95.2 C96.2 C97.2 C98.2 C99.2 C100.2 C101.2 C102.2 DD6.2(VCCIO1) DD6.13(VCCIO2) DD6.43(VCCIO3) DD6.52(VCCIO4) DD6.61(VCCIO5) DD6.72(VCCIO6) R82.2 R83.2 R84.2 R86.2 R87.2 R93.2
+5V: L8.1 X12.4
+5V_REFB: C105.2 C106.2 C107.2 DD6.23(V5) L8.2 R80.2 R89.2
+24V: X12.7
GND: C91.1 C92.1 C93.1 C94.1 C95.1 C96.1 C97.1 C98.1 C99.1 C100.1 C101.1 C102.1 C103.1 C104.1 C105.1 C106.1 C107.1 C108.1 DD6.3(GNDIO1) DD6.14(GNDIO2) DD6.24(GNDA) DD6.44(GNDIO3) DD6.53(GNDIO4) DD6.54(TEST) DD6.62(GNDIO5) DD6.73(GNDIO6) DD6.77(GNDPAD) R78.2 R79.2 R81.1 R85.2 R88.2 R90.2 R91.2 R92.1 X12.1 X12.10 X12.13 X12.16 X12.19 X12.23 X12.25 X12.27
B_EEPROM_A0: R85.1 X12.18
B_EEPROM_A1: R83.1 X12.17
B_I0_N: C103.2 DD6.17(ADC_I0_NEG) R80.1 R81.2
B_I0_P: DD6.16(ADC_I0_POS) TP26.1 X12.24
B_I1_N: C104.2 DD6.19(ADC_I1_NEG) R89.1 R92.2
B_I1_P: DD6.18(ADC_I1_POS) TP27.1 X12.26
B_I_Common: X12.22
B_PWM_UX1_H: DD6.39(PWM_UX1_H) TP16.1 X12.2
B_PWM_UX1_L: DD6.40(PWM_UX1_L) TP17.1 X12.3
B_PWM_VX2_H: DD6.41(PWM_VX2_H) TP18.1 X12.5
B_PWM_VX2_L: DD6.42(PWM_VX2_L) TP19.1 X12.6
B_PWM_WY1_H: DD6.46(PWM_WY1_H) TP20.1 X12.8
B_PWM_WY1_L: DD6.47(PWM_WY1_L) TP21.1 X12.9
B_PWM_Y2_H: DD6.48(PWM_Y2_H) TP22.1 X12.11
B_PWM_Y2_L: DD6.49(PWM_Y2_L) TP23.1 X12.12
BRAKE_B: DD6.31(BRAKE) TP24.1 X12.20
DRV_B_EN: DD6.32(ENO) TP25.1 X12.21
EEPROM_SCL: X12.14
EEPROM_SDA: X12.15
INC_ENC_2_A: DD6.35(ENC_A)
INC_ENC_2_B: DD6.34(ENC_B)
MCU_nRST: R94.2
T_SENSE_B_1: X12.29
T_SENSE_B_2: X12.30
TMC_B_CLK: DD6.51(CLK)
TMC_B_CS: DD6.6(SPI_nSCS) R82.1
TMC_B_DIR: DD6.56(DIR) R91.1
TMC_B_EN: DD6.55(ENI) R88.1
TMC_B_MISO: DD6.9(SPI_MISO) R84.1
TMC_B_MOSI: DD6.8(SPI_MOSI)
TMC_B_nRST: C108.2 DD6.50(nRST) R93.1 R94.1
TMC_B_RX: DD6.11(UART_TXD) R87.1
TMC_B_SCK: DD6.7(SPI_SCK)
TMC_B_STAT: DD6.12(STATUS)
TMC_B_STEP: DD6.57(STP) R90.1
TMC_B_TX: DD6.10(UART_RXD) R86.1
VM_B_DIV: C91.2 DD6.20(ADC_VM) X12.28
NetC92_2: C92.2 DD6.15(VCCCORE1)
NetC93_2: C93.2 DD6.45(VCCCORE2)
NetC94_2: C94.2 DD6.63(VCCCORE3)
NetDD6_59: DD6.59(PWM_IDLE_H) R78.1
NetDD6_60: DD6.60(PWM_IDLE_L) R79.1

Not connected (* = marked no-connect by the designer): DD6 1(GPIO5/AENC_UX_MCD)* 4(GPIO6/AENC_VN_MCD)* 5(GPIO7/AENC_WY_MCD)* 21(AGPI_A)* 22(AGPI_B)* 25(AENC_UX_POS)* 26(AENC_UX_NEG)* 27(AENC_VN_POS)* 28(AENC_VN_NEG)* 29(AENC_WY_POS)* 30(AENC_WY_NEG)* 33(ENC_N)* 36(HALL_WY)* 37(HALL_V)* 38(HALL_UX)* 58(PWM_I)* 64(ENC2_A)* 65(ENC2_B)* 66(ENC2_N)* 67(REF_L)* 68(REF_H)* 69(REF_R)* 70(GPIO0/ADC_I0_MCD)* 71(GPIO1/ADC_I1_MCD)* 74(GPIO2/ADC_VM_MCD)* 75(GPIO3/AGPI_A_MCD)* 76(GPIO4/AGPI_B_MCD)*

### Notes on the sheet
- Подп. и дата
- Инв. № дубл.
- Взам. инв. №
- Инв. № подл.
- Лист
- Изм.
- № докум.
- Подп.
- Дата
- Копировал
- Формат А3

### Library data of the parts
C91-C100 C103 C104 C106 C108 = CL10B104KB8NNNC: as C3 on sheet MCU; Артикул: CL10B104KB8NNNC; Номинал: 0.1uF; Строка для документации: https://mm.digikey.com/Volume0/opasdata/d220001/medias/docus/609/CL10B104KB8NNNC_Spec.pdf; Тип элемента: Конденсатор
C101 C102 = CL21A226MOCLRNC: as C36 on sheet DRIVER_A; Артикул: CL21A226MOCLRNC; Номинал: 22uF; Строка для документации: https://mm.digikey.com/Volume0/opasdata/d220001/medias/docus/43/CL21A226MOCLRNC_Spec.pdf; Тип элемента: Конденсатор
C105 = CL10B105KO8NNNC: as C40 on sheet DRIVER_A; Артикул: CL10B105KO8NNNC; Номинал: 1uF; Строка для документации: https://weblib.samsungsem.com/mlcc/mlcc-ec-data-sheet.do?partNumber=CL10B105KO8NNN; Тип элемента: Конденсатор
C107 = CL10A475KO8NNNC: as C11 on sheet MCU; Артикул: CL10A475KO8NNNC; Номинал: 4.7uF; Строка для документации: https://mm.digikey.com/Volume0/opasdata/d220001/medias/docus/2328/CL10A475KO8NNNC_Spec.pdf; Тип элемента: Конденсатор
DD6 = TMC4671-LA: as DD2 on sheet DRIVER_A; Артикул: TMC4671-LA; Строка для документации: https://www.analog.com/media/en/technical-documentation/data-sheets/TMC4671-LA_datasheet_Rev2.07.pdf; Тип элемента: Микросхема
L8 = BLM18AG601SN1D: as L1 on sheet MCU; Артикул: BLM18AG601SN1D; Номинал: 600 @ 100MHz; Строка для документации: https://www.murata.com/en-us/products/productdata/8796738650142/ENFA0003.pdf; Тип элемента: Фильтр ЭМП
R78-R93 = RC0603FR-0710KL: as R4 on sheet MCU; Артикул: RC0603FR-0710KL; Номинал: 10k; Строка для документации: https://www.yageo.com/upload/media/product/app/datasheet/rchip/pyu-rc_group_51_rohs_l.pdf; Тип элемента: Резистор
R94 = RC0603FR-070RL: as R14 on sheet MCU; Артикул: RC0603FR-070RL; Номинал: 0; Строка для документации: https://www.yageo.com/upload/media/product/app/datasheet/rchip/pyu-rc_group_51_rohs_l.pdf; Тип элемента: Резистор
TP16-TP27 = Test Point, Round Pad, 0.8mm diameter: as TP1 on sheet DRIVER_A; Артикул: Test Point, Round Pad, 0.8mm diameter; Тип разъема: Test Point; Описание: Test Point, Round Pad, 0.8mm diameter
X12 = DS1023-2X15S21: as X5 on sheet DRIVER_A; Артикул: DS1023-2X15S21; Строка для документации: http://cn.connfly.group/static/upload/file/pdf/DS1023.pdf; Тип элемента: Разъем

## Sheet ABS_ENC_IF.SchDoc
size 420 x 297 mm; SheetNumber: 4; PageSetup: Record=PageOptions|CenterHorizontal=False|CenterVertical=False|PrintScale=0.95|XCorrection=0.00|YCorrection=0.00|PrintKind=1|BorderSize=5000000|LeftOffset=0|BottomOffset=0|Orientation=1|PaperLength=1000|PaperWidth=1000|Scale=100|PaperSource=15|PrintQuality=600|MediaType=1|DitherType=10|PaperKind=A4|PrintScaleMode=1
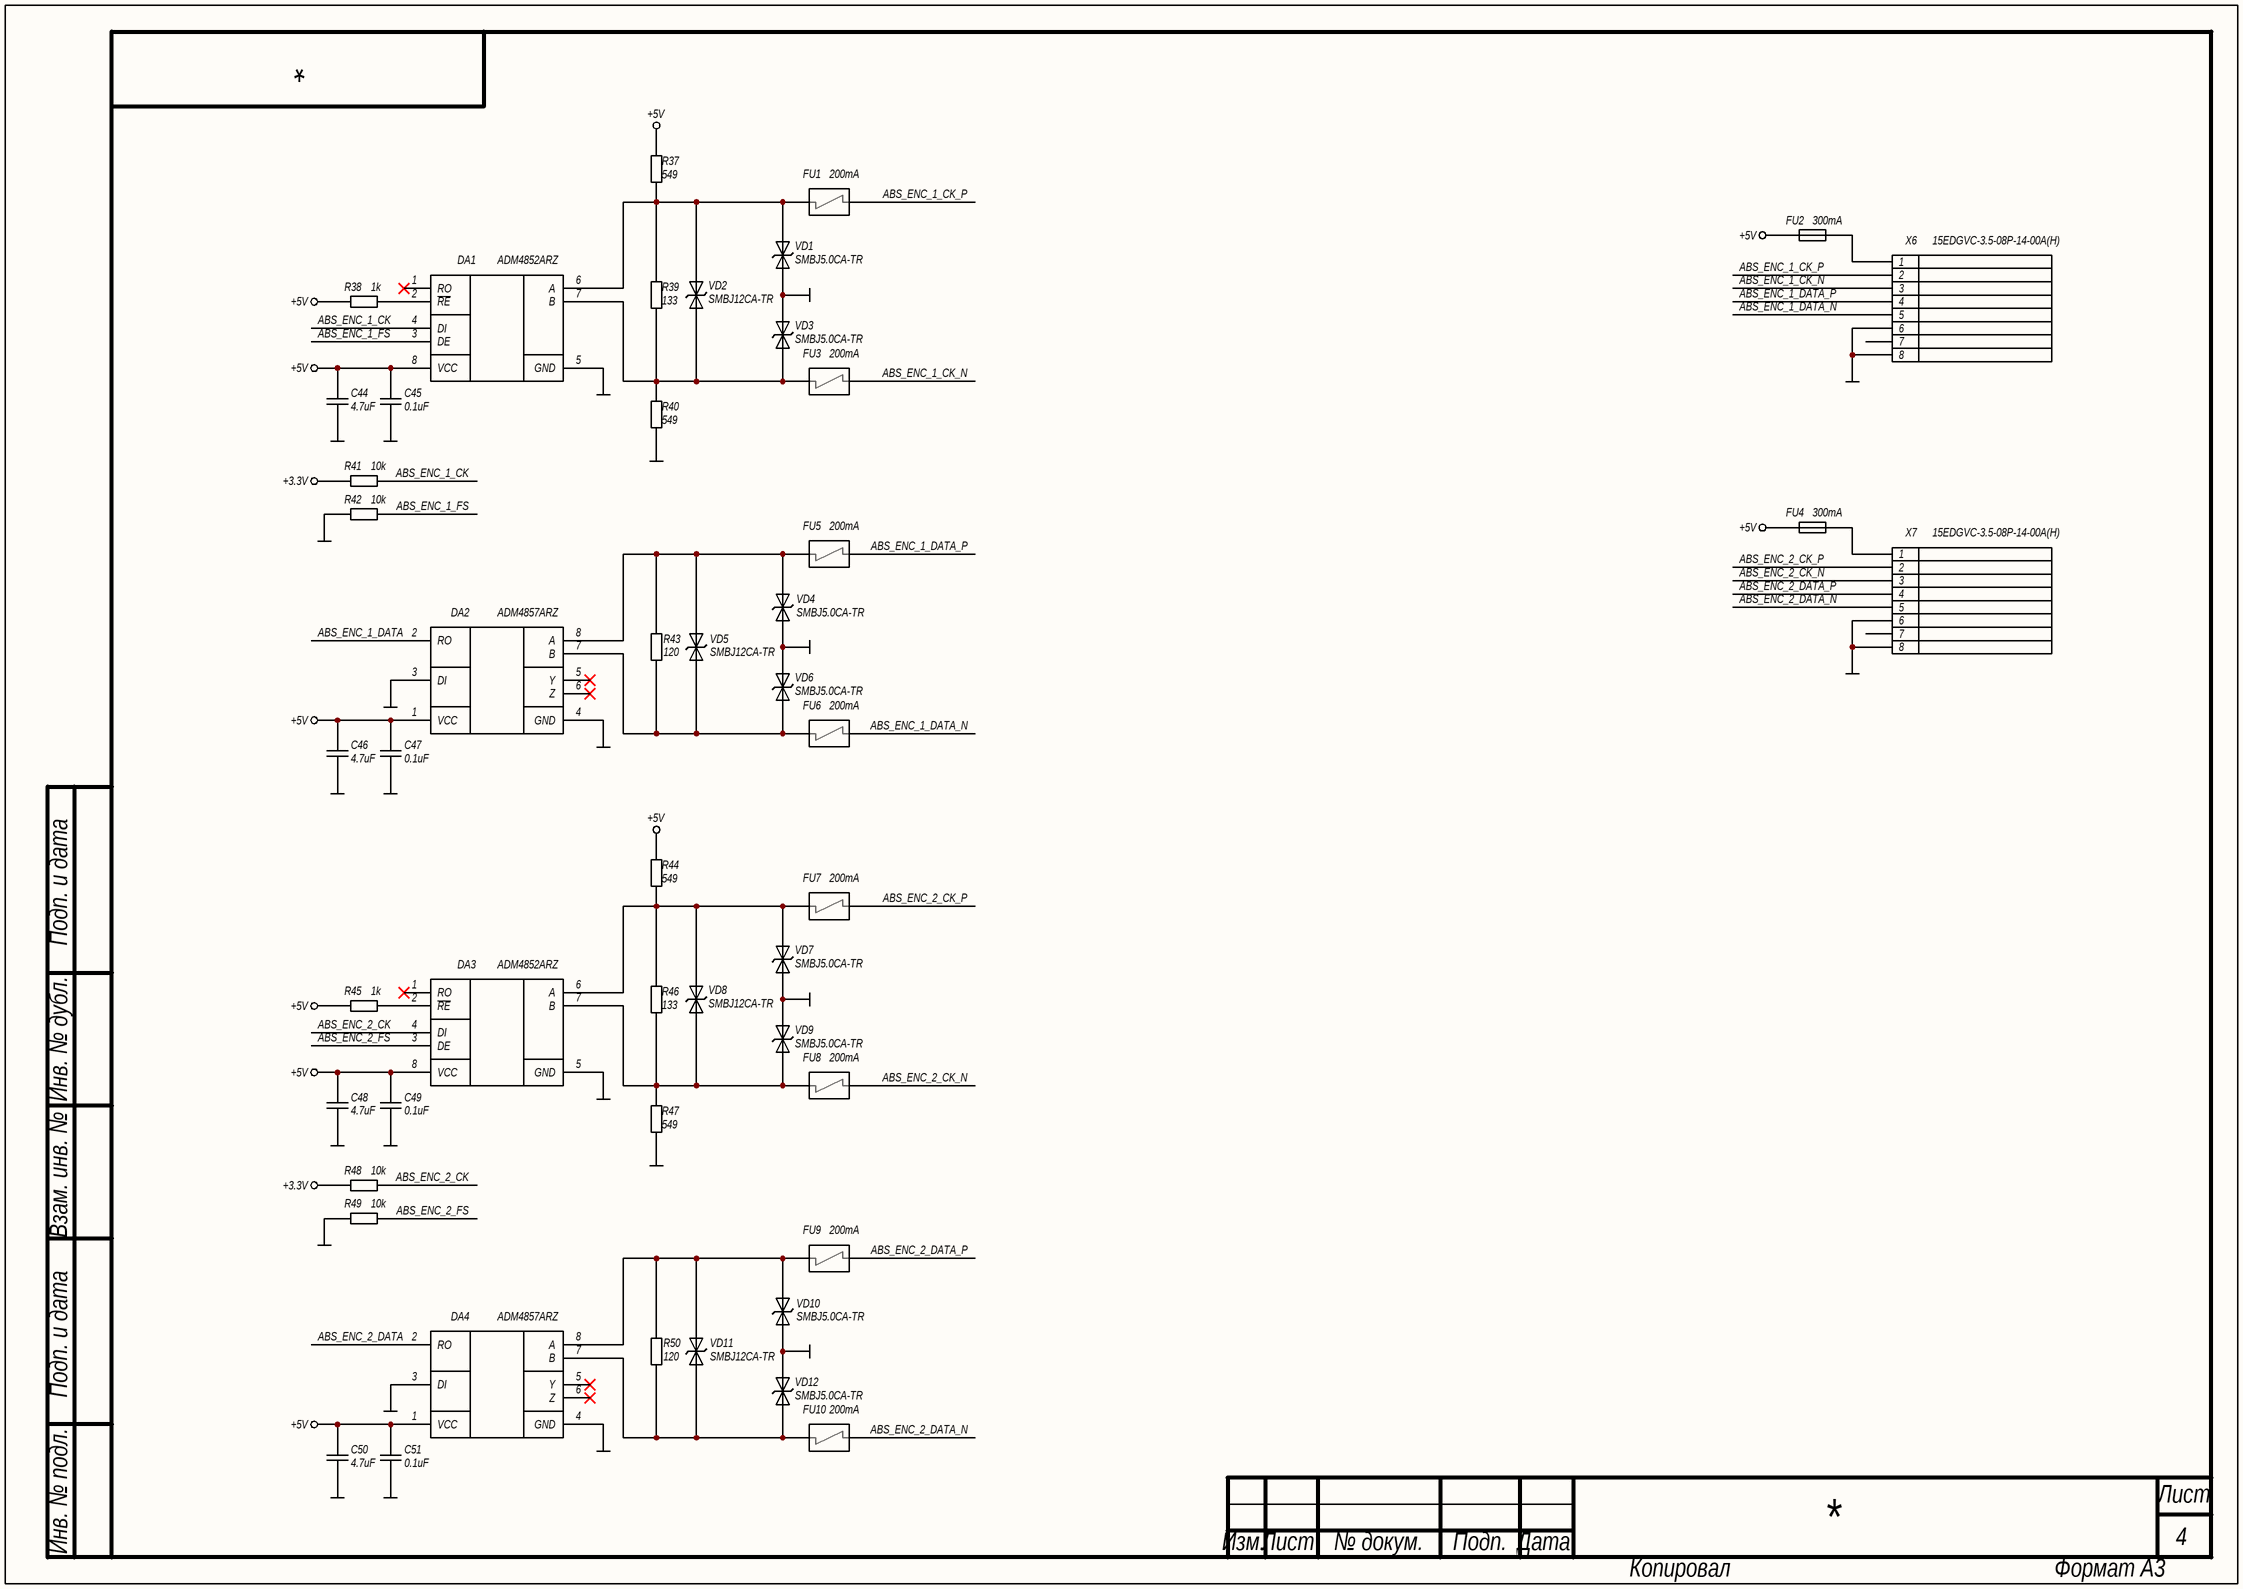
[diagram p3: ABS_ENC_IF.SchDoc]

### Parts
C44  4.7uF  [C0603N]
C45  0.1uF  [C0603N]
C46  4.7uF  [C0603N]
C47  0.1uF  [C0603N]
C48  4.7uF  [C0603N]
C49  0.1uF  [C0603N]
C50  4.7uF  [C0603N]
C51  0.1uF  [C0603N]
DA1  ADM4852ARZ  [SOIC8]
DA2  ADM4857ARZ  [SOIC8]
DA3  ADM4852ARZ  [SOIC8]
DA4  ADM4857ARZ  [SOIC8]
FU1  200mA  [TBU-CA]
FU2  300mA  [MF-MSMF]
FU3  200mA  [TBU-CA]
FU4  300mA  [MF-MSMF]
FU5  200mA  [TBU-CA]
FU6  200mA  [TBU-CA]
FU7  200mA  [TBU-CA]
FU8  200mA  [TBU-CA]
FU9  200mA  [TBU-CA]
FU10  200mA  [TBU-CA]
R37  549  [R0805N]
R38  1k  [R0603N]
R39  133  [R0805N]
R40  549  [R0805N]
R41  10k  [R0603N]
R42  10k  [R0603N]
R43  120  [R0805N]
R44  549  [R0805N]
R45  1k  [R0603N]
R46  133  [R0805N]
R47  549  [R0805N]
R48  10k  [R0603N]
R49  10k  [R0603N]
R50  120  [R0805N]
VD1  SMBJ5.0CA-TR  [SMB]
VD2  SMBJ12CA-TR  [SMB]
VD3  SMBJ5.0CA-TR  [SMB]
VD4  SMBJ5.0CA-TR  [SMB]
VD5  SMBJ12CA-TR  [SMB]
VD6  SMBJ5.0CA-TR  [SMB]
VD7  SMBJ5.0CA-TR  [SMB]
VD8  SMBJ12CA-TR  [SMB]
VD9  SMBJ5.0CA-TR  [SMB]
VD10  SMBJ5.0CA-TR  [SMB]
VD11  SMBJ12CA-TR  [SMB]
VD12  SMBJ5.0CA-TR  [SMB]
X6  15EDGVC-3.5-08P-14-00A(H)  [15EDGVC-3.5-08P-14-00A(H)]
X7  15EDGVC-3.5-08P-14-00A(H)  [15EDGVC-3.5-08P-14-00A(H)]

### Nets
+3.3V: R41.2 R48.2
+5V: C44.2 C45.2 C46.2 C47.2 C48.2 C49.2 C50.2 C51.2 DA1.8(VCC) DA2.1(VCC) DA3.8(VCC) DA4.1(VCC) FU2.1 FU4.1 R37.2 R38.2 R44.2 R45.2
GND: C44.1 C45.1 C46.1 C47.1 C48.1 C49.1 C50.1 C51.1 DA1.5(GND) DA2.3(DI) DA2.4(GND) DA3.5(GND) DA4.3(DI) DA4.4(GND) R40.1 R42.2 R47.1 R49.2 VD1.2(A2) VD3.2(A2) VD4.2(A2) VD6.2(A2) VD7.2(A2) VD9.2(A2) VD10.2(A2) VD12.2(A2) X6.6 X6.8 X7.6 X7.8
ABS_ENC_1_CK: DA1.4(DI) R41.1
ABS_ENC_1_CK_N: FU3.3(IN/OUT) X6.3
ABS_ENC_1_CK_P: FU1.3(IN/OUT) X6.2
ABS_ENC_1_DATA: DA2.2(RO)
ABS_ENC_1_DATA_N: FU6.3(IN/OUT) X6.5
ABS_ENC_1_DATA_P: FU5.3(IN/OUT) X6.4
ABS_ENC_1_FS: DA1.3(DE) R42.1
ABS_ENC_2_CK: DA3.4(DI) R48.1
ABS_ENC_2_CK_N: FU8.3(IN/OUT) X7.3
ABS_ENC_2_CK_P: FU7.3(IN/OUT) X7.2
ABS_ENC_2_DATA: DA4.2(RO)
ABS_ENC_2_DATA_N: FU10.3(IN/OUT) X7.5
ABS_ENC_2_DATA_P: FU9.3(IN/OUT) X7.4
ABS_ENC_2_FS: DA3.3(DE) R49.1
NetDA1_2: DA1.2(~{RE}) R38.1
NetDA1_6: DA1.6(A) FU1.1(IN/OUT) R37.1 R39.2 VD1.1(A1) VD2.1(A1)
NetDA1_7: DA1.7(B) FU3.1(IN/OUT) R39.1 R40.2 VD2.2(A2) VD3.1(A1)
NetDA2_7: DA2.7(B) FU6.1(IN/OUT) R43.2 VD5.2(A2) VD6.1(A1)
NetDA2_8: DA2.8(A) FU5.1(IN/OUT) R43.1 VD4.1(A1) VD5.1(A1)
NetDA3_2: DA3.2(~{RE}) R45.1
NetDA3_6: DA3.6(A) FU7.1(IN/OUT) R44.1 R46.2 VD7.1(A1) VD8.1(A1)
NetDA3_7: DA3.7(B) FU8.1(IN/OUT) R46.1 R47.2 VD8.2(A2) VD9.1(A1)
NetDA4_7: DA4.7(B) FU10.1(IN/OUT) R50.2 VD11.2(A2) VD12.1(A1)
NetDA4_8: DA4.8(A) FU9.1(IN/OUT) R50.1 VD10.1(A1) VD11.1(A1)
NetFU2_2: FU2.2 X6.1
NetFU4_2: FU4.2 X7.1

Not connected (* = marked no-connect by the designer): DA1 1(RO)*; DA2 5(Y)* 6(Z)*; DA3 1(RO)*; DA4 5(Y)* 6(Z)*; X6 7; X7 7

### Notes on the sheet
- Подп. и дата
- Инв. № дубл.
- Взам. инв. №
- Инв. № подл.
- Лист
- Изм.
- № докум.
- Подп.
- Дата
- Копировал
- Формат А3

### Library data of the parts
C44 C46 C48 C50 = CL10A475KO8NNNC: as C11 on sheet MCU; Артикул: CL10A475KO8NNNC; Номинал: 4.7uF; Строка для документации: https://mm.digikey.com/Volume0/opasdata/d220001/medias/docus/2328/CL10A475KO8NNNC_Spec.pdf; Тип элемента: Конденсатор
C45 C47 C49 C51 = CL10B104KB8NNNC: as C3 on sheet MCU; Артикул: CL10B104KB8NNNC; Номинал: 0.1uF; Строка для документации: https://mm.digikey.com/Volume0/opasdata/d220001/medias/docus/609/CL10B104KB8NNNC_Spec.pdf; Тип элемента: Конденсатор
DA1 DA3 = ADM4852ARZ: Микросхема интерфейса RS485; Производитель: "D:\Altium\Libraries\GOST_LIBS\Libraries\IC\Analog Devices\ADM4852A.SchLib"; Описание: 1/1 Transceiver Half RS422, RS485 8-SOIC; Корпус: 8-SOIC (0.154", 3.90mm Width); Температурный диапазон: -40°C ~ 85°C; Вид монтажа: SMD; Артикул: ADM4852ARZ; Строка для документации: https://www.analog.com/media/en/technical-documentation/data-sheets/ADM4850_4851_4852_4853_4854_4855_4856_4857.pdf; Тип элемента: Микросхема
DA2 DA4 = ADM4857ARZ: Микросхема интерфейса RS485; Производитель: "D:\Altium\Libraries\GOST_LIBS\Libraries\IC\Analog Devices\ADM4852A.SchLib"; Описание: 1/1 Transceiver Full RS422, RS485 8-SOIC; Корпус: 8-SOIC (0.154", 3.90mm Width); Температурный диапазон: -40°C ~ 85°C; Вид монтажа: SMD; Артикул: ADM4857ARZ; Строка для документации: https://www.analog.com/media/en/technical-documentation/data-sheets/ADM4850_4851_4852_4853_4854_4855_4856_4857.pdf; Тип элемента: Микросхема
FU1 FU3 FU5-FU10 = TBU-CA065-200-WH: Полупроводниковый предохранитель; Напряжение: 650V; Тип: Surge Suppression IС; Производитель: Bourns Inc.; Описание: SURGE SUPP TBU 200MA 650VIMP SMD; Корпус: 6.50mm x 4.00mm; Температурный диапазон: -55°C ~ 125°C; Вид монтажа: SMD; Артикул: TBU-CA065-200-WH; Ток: 200mA; Строка для документации: https://www.bourns.com/docs/Product-Datasheets/TBU-CA.pdf; Тип элемента: Предохранитель
FU2 FU4 = MF-MSMF030-2: Плавкий предохранитель; Напряжение: 30V; Тип: PTC Resettable Fuse; Производитель: Bourns Inc.; Описание: Polymeric PTC Resettable Fuse 30V 300 mA Ih Surface Mount 1812 (4532 Metric), Concave; Корпус: 1812 (4532 Metric), Concave; Температурный диапазон: -40°C ~ 85°C; Вид монтажа: SMD; Артикул: MF-MSMF030-2; Ток: 300mA; Строка для документации: https://www.bourns.com/docs/product-datasheets/mf-msmf.pdf; Тип элемента: Предохранитель
R37 R40 R44 R47 = RC0805FR-07549RL: Резистор; Точность: 1%; ТКС: ±100ppm/°C; Напряжение: 150V; Производитель: YAGEO; Описание: 549 Ohms ±1% 0.125W, 1/8W Chip Resistor 0805 (2012 Metric) Moisture Resistant Thick Film; Корпус: 0805 (2012 Metric); Температурный диапазон: -55°C ~ 155°C; Вид монтажа: SMD; Артикул: RC0805FR-07549RL; Номинал: 549; Строка для документации: https://www.yageo.com/upload/media/product/productsearch/datasheet/rchip/PYu-RC_Group_51_RoHS_L_12.pdf; Тип элемента: Резистор
R38 R45 = RC0603FR-071KL: as R1 on sheet MCU; Артикул: RC0603FR-071KL; Номинал: 1k; Строка для документации: https://www.yageo.com/upload/media/product/app/datasheet/rchip/pyu-rc_group_51_rohs_l.pdf; Тип элемента: Резистор
R39 R46 = RC0805FR-07133RL: Резистор; Точность: 1%; ТКС: ±100ppm/°C; Напряжение: 150V; Производитель: YAGEO; Описание: 133 Ohms ±1% 0.125W, 1/8W Chip Resistor 0805 (2012 Metric) Moisture Resistant Thick Film; Корпус: 0805 (2012 Metric); Температурный диапазон: -55°C ~ 155°C; Вид монтажа: SMD; Артикул: RC0805FR-07133RL; Номинал: 133; Строка для документации: https://www.yageo.com/upload/media/product/productsearch/datasheet/rchip/PYu-RC_Group_51_RoHS_L_12.pdf; Тип элемента: Резистор
R41 R42 R48 R49 = RC0603FR-0710KL: as R4 on sheet MCU; Артикул: RC0603FR-0710KL; Номинал: 10k; Строка для документации: https://www.yageo.com/upload/media/product/app/datasheet/rchip/pyu-rc_group_51_rohs_l.pdf; Тип элемента: Резистор
R43 R50 = RC0805FR-07120RL: Резистор; Точность: 1%; ТКС: ±100ppm/°C; Напряжение: 150V; Производитель: YAGEO; Описание: 120 Ohms ±1% 0.125W, 1/8W Chip Resistor 0805 (2012 Metric) Moisture Resistant Thick Film; Корпус: 0805 (2012 Metric); Температурный диапазон: -55°C ~ 155°C; Вид монтажа: SMD; Артикул: RC0805FR-07120RL; Номинал: 120; Строка для документации: https://www.yageo.com/upload/media/product/productsearch/datasheet/rchip/PYu-RC_Group_51_RoHS_L_12.pdf; Тип элемента: Резистор
VD1 VD3 VD4 VD6 VD7 VD9 VD10 VD12 = SMBJ5.0CA-TR: TVS диод двунаправленный; Напряжение: 5V; Напряжение ограничения: 9.2V; Напряжение пробоя: 6.4V; Ток: 68A; Тип: TVS Bidirectional; Производитель: STMicroelectronics; Описание: 9.2V Clamp 68A Ipp Tvs Diode Surface Mount SMB (DO-214AA); Корпус: DO-214AA, SMB; Температурный диапазон: -55°C ~ 150°C (TJ); Вид монтажа: SMD; Тип элемента: Диод защитный; Артикул: SMBJ5.0CA-TR; Строка для документации: https://www.st.com/content/ccc/resource/technical/document/datasheet/19/78/91/39/07/cd/40/65/CD00001366.pdf/files/CD00001366.pdf/_jcr_content/translations/en.CD00001366.pdf
VD2 VD5 VD8 VD11 = SMBJ12CA-TR: TVS диод двунаправленный; Напряжение: 12V; Напряжение ограничения: 19.9V; Напряжение пробоя: 13.3V; Ток: 31A; Тип: TVS Bidirectional; Производитель: STMicroelectronics; Описание: 19.9V Clamp 31A Ipp Tvs Diode Surface Mount SMB (DO-214AA); Корпус: DO-214AA, SMB; Температурный диапазон: -55°C ~ 150°C (TJ); Вид монтажа: SMD; Тип элемента: Диод защитный; Артикул: SMBJ12CA-TR; Строка для документации: https://www.st.com/content/ccc/resource/technical/document/datasheet/19/78/91/39/07/cd/40/65/CD00001366.pdf/files/CD00001366.pdf/_jcr_content/translations/en.CD00001366.pdf
X6 X7 = 15EDGVC-3.5-08P-14-00A(H): Разъем, 8 контактов; Тип разъема: Pluggable terminal block; Количество контактов: 8; Шаг контактов: 3.5mm; Ток: 7A; Напряжение: 250V; Производитель: Degson Electronics; Описание: Pluggable terminal block; 3.5mm; ways: 8; straight; socket; male; Температурный диапазон: -40°C ~ 105°C; Вид монтажа: Through Hole; Артикул: 15EDGVC-3.5-08P-14-00A(H); Строка для документации: https://www.tme.eu/Document/83e7173fe653a2d0e44585e87978945b/opr014R8.pdf; Тип элемента: Разъем

## Sheet INC_ENC_IF.SchDoc
size 420 x 297 mm; SheetNumber: 5; PageSetup: Record=PageOptions|CenterHorizontal=False|CenterVertical=False|PrintScale=0.95|XCorrection=0.00|YCorrection=0.00|PrintKind=1|BorderSize=5000000|LeftOffset=0|BottomOffset=0|Orientation=1|PaperLength=1000|PaperWidth=1000|Scale=100|PaperSource=15|PrintQuality=600|MediaType=1|DitherType=10|PaperKind=A4|PrintScaleMode=1
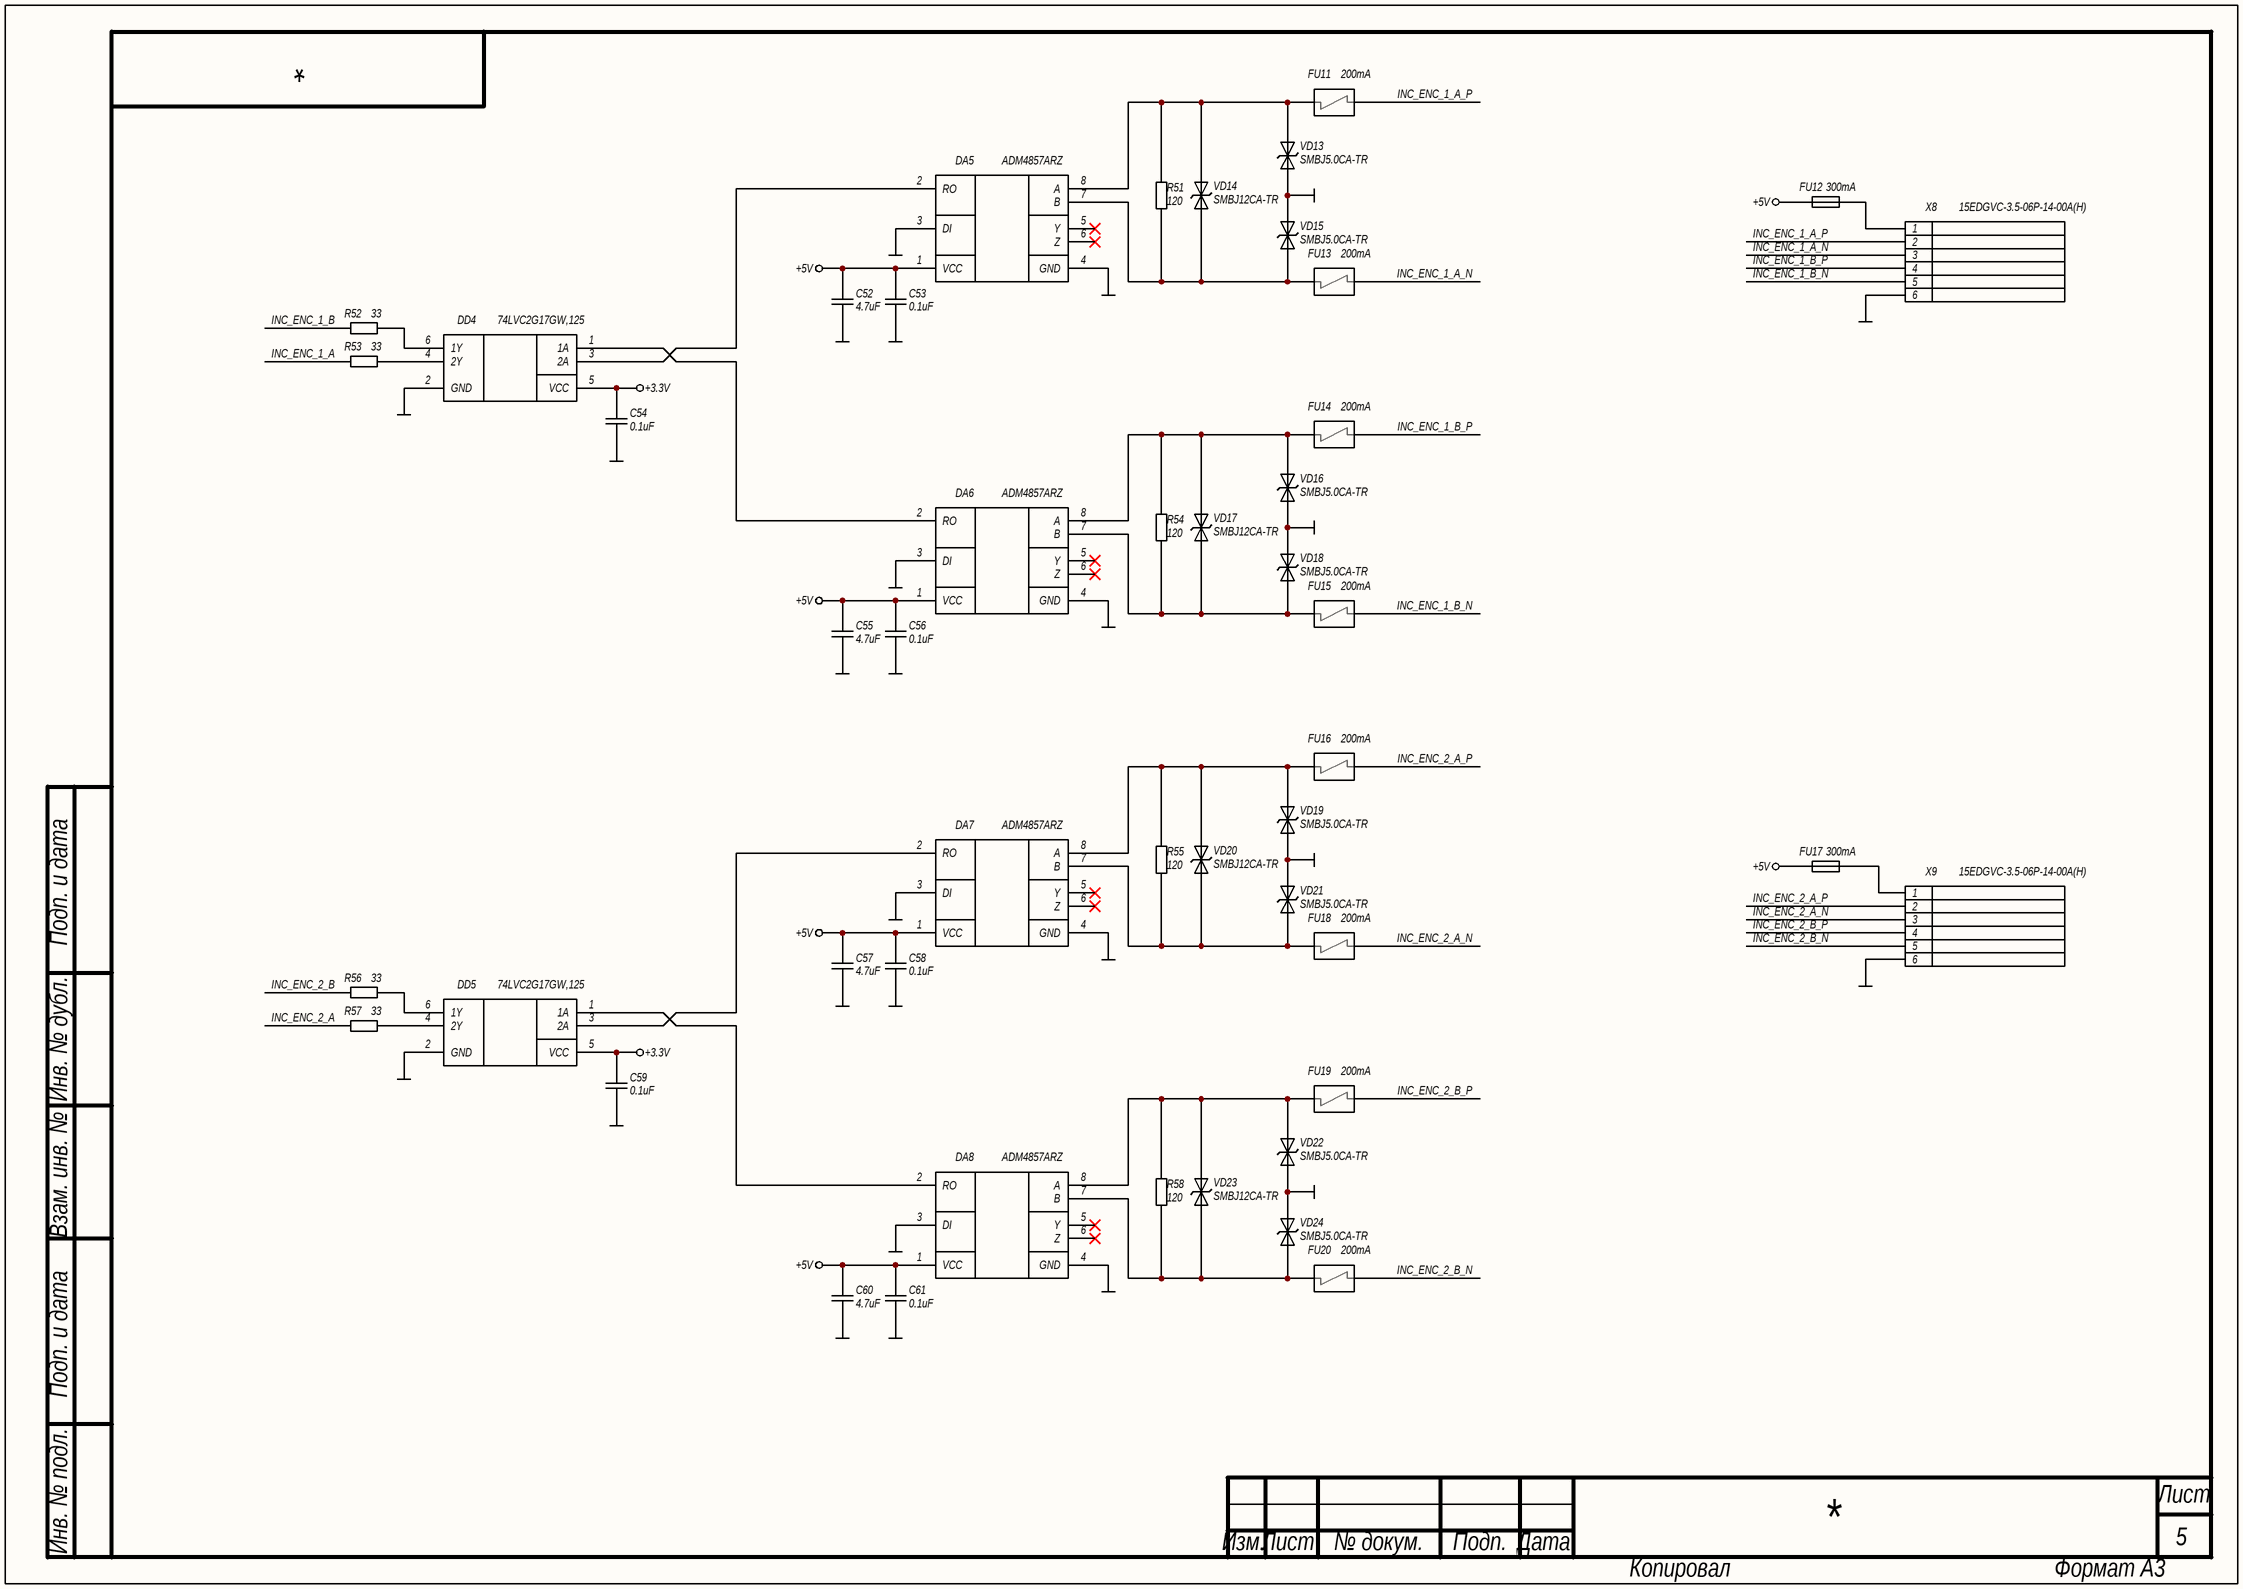
[diagram p4: INC_ENC_IF.SchDoc]

### Parts
C52  4.7uF  [C0603N]
C53  0.1uF  [C0603N]
C54  0.1uF  [C0603N]
C55  4.7uF  [C0603N]
C56  0.1uF  [C0603N]
C57  4.7uF  [C0603N]
C58  0.1uF  [C0603N]
C59  0.1uF  [C0603N]
C60  4.7uF  [C0603N]
C61  0.1uF  [C0603N]
DA5  ADM4857ARZ  [SOIC8]
DA6  ADM4857ARZ  [SOIC8]
DA7  ADM4857ARZ  [SOIC8]
DA8  ADM4857ARZ  [SOIC8]
DD4  74LVC2G17GW,125  [SOT363-2]
DD5  74LVC2G17GW,125  [SOT363-2]
FU11  200mA  [TBU-CA]
FU12  300mA  [MF-MSMF]
FU13  200mA  [TBU-CA]
FU14  200mA  [TBU-CA]
FU15  200mA  [TBU-CA]
FU16  200mA  [TBU-CA]
FU17  300mA  [MF-MSMF]
FU18  200mA  [TBU-CA]
FU19  200mA  [TBU-CA]
FU20  200mA  [TBU-CA]
R51  120  [R0805N]
R52  33  [R0603N]
R53  33  [R0603N]
R54  120  [R0805N]
R55  120  [R0805N]
R56  33  [R0603N]
R57  33  [R0603N]
R58  120  [R0805N]
VD13  SMBJ5.0CA-TR  [SMB]
VD14  SMBJ12CA-TR  [SMB]
VD15  SMBJ5.0CA-TR  [SMB]
VD16  SMBJ5.0CA-TR  [SMB]
VD17  SMBJ12CA-TR  [SMB]
VD18  SMBJ5.0CA-TR  [SMB]
VD19  SMBJ5.0CA-TR  [SMB]
VD20  SMBJ12CA-TR  [SMB]
VD21  SMBJ5.0CA-TR  [SMB]
VD22  SMBJ5.0CA-TR  [SMB]
VD23  SMBJ12CA-TR  [SMB]
VD24  SMBJ5.0CA-TR  [SMB]
X8  15EDGVC-3.5-06P-14-00A(H)  [15EDGVC-3.5-06P-14-00A(H)]
X9  15EDGVC-3.5-06P-14-00A(H)  [15EDGVC-3.5-06P-14-00A(H)]

### Nets
+3.3V: C54.2 C59.2 DD4.5(VCC) DD5.5(VCC)
+5V: C52.2 C53.2 C55.2 C56.2 C57.2 C58.2 C60.2 C61.2 DA5.1(VCC) DA6.1(VCC) DA7.1(VCC) DA8.1(VCC) FU12.1 FU17.1
GND: C52.1 C53.1 C54.1 C55.1 C56.1 C57.1 C58.1 C59.1 C60.1 C61.1 DA5.3(DI) DA5.4(GND) DA6.3(DI) DA6.4(GND) DA7.3(DI) DA7.4(GND) DA8.3(DI) DA8.4(GND) DD4.2(GND) DD5.2(GND) VD13.2(A2) VD15.2(A2) VD16.2(A2) VD18.2(A2) VD19.2(A2) VD21.2(A2) VD22.2(A2) VD24.2(A2) X8.6 X9.6
INC_ENC_1_A: R53.2
INC_ENC_1_A_N: FU13.3(IN/OUT) X8.3
INC_ENC_1_A_P: FU11.3(IN/OUT) X8.2
INC_ENC_1_B: R52.2
INC_ENC_1_B_N: FU15.3(IN/OUT) X8.5
INC_ENC_1_B_P: FU14.3(IN/OUT) X8.4
INC_ENC_2_A: R57.2
INC_ENC_2_A_N: FU18.3(IN/OUT) X9.3
INC_ENC_2_A_P: FU16.3(IN/OUT) X9.2
INC_ENC_2_B: R56.2
INC_ENC_2_B_N: FU20.3(IN/OUT) X9.5
INC_ENC_2_B_P: FU19.3(IN/OUT) X9.4
NetDA5_2: DA5.2(RO) DD4.3(2A)
NetDA5_7: DA5.7(B) FU13.1(IN/OUT) R51.2 VD14.2(A2) VD15.1(A1)
NetDA5_8: DA5.8(A) FU11.1(IN/OUT) R51.1 VD13.1(A1) VD14.1(A1)
NetDA6_2: DA6.2(RO) DD4.1(1A)
NetDA6_7: DA6.7(B) FU15.1(IN/OUT) R54.2 VD17.2(A2) VD18.1(A1)
NetDA6_8: DA6.8(A) FU14.1(IN/OUT) R54.1 VD16.1(A1) VD17.1(A1)
NetDA7_2: DA7.2(RO) DD5.3(2A)
NetDA7_7: DA7.7(B) FU18.1(IN/OUT) R55.2 VD20.2(A2) VD21.1(A1)
NetDA7_8: DA7.8(A) FU16.1(IN/OUT) R55.1 VD19.1(A1) VD20.1(A1)
NetDA8_2: DA8.2(RO) DD5.1(1A)
NetDA8_7: DA8.7(B) FU20.1(IN/OUT) R58.2 VD23.2(A2) VD24.1(A1)
NetDA8_8: DA8.8(A) FU19.1(IN/OUT) R58.1 VD22.1(A1) VD23.1(A1)
NetDD4_4: DD4.4(2Y) R53.1
NetDD4_6: DD4.6(1Y) R52.1
NetDD5_4: DD5.4(2Y) R57.1
NetDD5_6: DD5.6(1Y) R56.1
NetFU12_2: FU12.2 X8.1
NetFU17_2: FU17.2 X9.1

Not connected (* = marked no-connect by the designer): DA5 5(Y)* 6(Z)*; DA6 5(Y)* 6(Z)*; DA7 5(Y)* 6(Z)*; DA8 5(Y)* 6(Z)*

### Notes on the sheet
- Подп. и дата
- Инв. № дубл.
- Взам. инв. №
- Инв. № подл.
- Лист
- Изм.
- № докум.
- Подп.
- Дата
- Копировал
- Формат А3

### Library data of the parts
C52 C55 C57 C60 = CL10A475KO8NNNC: as C11 on sheet MCU; Артикул: CL10A475KO8NNNC; Номинал: 4.7uF; Строка для документации: https://mm.digikey.com/Volume0/opasdata/d220001/medias/docus/2328/CL10A475KO8NNNC_Spec.pdf; Тип элемента: Конденсатор
C53 C54 C56 C58 C59 C61 = CL10B104KB8NNNC: as C3 on sheet MCU; Артикул: CL10B104KB8NNNC; Номинал: 0.1uF; Строка для документации: https://mm.digikey.com/Volume0/opasdata/d220001/medias/docus/609/CL10B104KB8NNNC_Spec.pdf; Тип элемента: Конденсатор
DA5-DA8 = ADM4857ARZ: as DA2 on sheet ABS_ENC_IF; Артикул: ADM4857ARZ; Строка для документации: https://www.analog.com/media/en/technical-documentation/data-sheets/ADM4850_4851_4852_4853_4854_4855_4856_4857.pdf; Тип элемента: Микросхема
DD4 DD5 = 74LVC2G17GW,125: Микросхема сдвоенный триггер Шмитта; Производитель: Nexperia USA Inc.; Описание: Buffer, Non-Inverting 2 Element 1 Bit per Element Push-Pull Output 6-TSSOP; Корпус: 6-TSSOP; Температурный диапазон: -40°C ~ 125°C (TA); Вид монтажа: SMD; Артикул: 74LVC2G17GW,125; Строка для документации: https://assets.nexperia.com/documents/data-sheet/74LVC2G17.pdf; Тип элемента: Микросхема
FU11 FU13-FU16 FU18-FU20 = TBU-CA065-200-WH: as FU1 on sheet ABS_ENC_IF; Артикул: TBU-CA065-200-WH; Ток: 200mA; Строка для документации: https://www.bourns.com/docs/Product-Datasheets/TBU-CA.pdf; Тип элемента: Предохранитель
FU12 FU17 = MF-MSMF030-2: as FU2 on sheet ABS_ENC_IF; Артикул: MF-MSMF030-2; Ток: 300mA; Строка для документации: https://www.bourns.com/docs/product-datasheets/mf-msmf.pdf; Тип элемента: Предохранитель
R51 R54 R55 R58 = RC0805FR-07120RL: as R43 on sheet ABS_ENC_IF; Артикул: RC0805FR-07120RL; Номинал: 120; Строка для документации: https://www.yageo.com/upload/media/product/productsearch/datasheet/rchip/PYu-RC_Group_51_RoHS_L_12.pdf; Тип элемента: Резистор
R52 R53 R56 R57 = RC0603FR-0733RL: as R20 on sheet DRIVER_A; Артикул: RC0603FR-0733RL; Номинал: 33; Строка для документации: https://www.yageo.com/upload/media/product/app/datasheet/rchip/pyu-rc_group_51_rohs_l.pdf; Тип элемента: Резистор
VD13 VD15 VD16 VD18 VD19 VD21 VD22 VD24 = SMBJ5.0CA-TR: as VD1 on sheet ABS_ENC_IF; Артикул: SMBJ5.0CA-TR; Строка для документации: https://www.st.com/content/ccc/resource/technical/document/datasheet/19/78/91/39/07/cd/40/65/CD00001366.pdf/files/CD00001366.pdf/_jcr_content/translations/en.CD00001366.pdf
VD14 VD17 VD20 VD23 = SMBJ12CA-TR: as VD2 on sheet ABS_ENC_IF; Артикул: SMBJ12CA-TR; Строка для документации: https://www.st.com/content/ccc/resource/technical/document/datasheet/19/78/91/39/07/cd/40/65/CD00001366.pdf/files/CD00001366.pdf/_jcr_content/translations/en.CD00001366.pdf
X8 X9 = 15EDGVC-3.5-06P-14-00A(H): Разъем, 6 контактов; Тип разъема: Pluggable terminal block; Количество контактов: 6; Шаг контактов: 3.5mm; Ток: 7A; Напряжение: 250V; Производитель: Degson Electronics; Описание: Pluggable terminal block; 3.5mm; ways: 6; straight; socket; male; Температурный диапазон: -40°C ~ 105°C; Вид монтажа: Through Hole; Артикул: 15EDGVC-3.5-06P-14-00A(H); Строка для документации: https://www.tme.eu/Document/83e7173fe653a2d0e44585e87978945b/opr014R8.pdf; Тип элемента: Разъем